# Altium project llrf_afe.PrjPcb (part 3 of 4)

## Sheet llrf_afe_pwr_single_ch.SchDoc: =GlobalProjectName
size 209 x 297 mm; Author: Styuf Alexey; Organization: CosyLab Siberia; Revision: v0.8; SheetNumber: 8; SheetTotal: 17; PageSetup: Record=PageOptions|CenterHorizontal=True|CenterVertical=True|PrintScale=1.00|XCorrection=1.00|YCorrection=1.00|PrintKind=1|BorderSize=5000000|LeftOffset=0|BottomOffset=0|Orientation=2|PaperLength=1000|PaperWidth=1000|Scale=100|PaperSource=15|PrintQuality=1200|MediaType=1|DitherType=10|PaperKind=A3|PrintScaleMode=1; Weight: -; ScaleFactor: -
Used 4 times, as channels pwr/3V3_pwr, pwr/2V5_pwr, pwr/1V8_pwr, pwr/1V2_pwr. Parts and nets are listed once, with the designators drawn on the sheet.
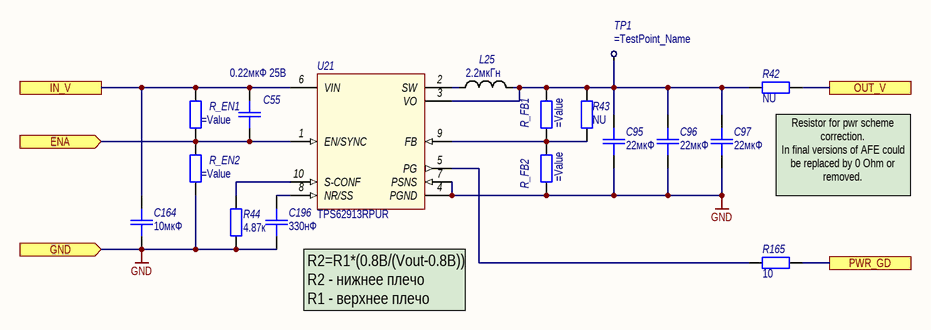
[diagram p13: llrf_afe_pwr_single_ch.SchDoc]

### Parts
C55  0.22мкФ 25В  [SMD_C0603]
C95  22мкФ  [SMD_C0805]
C96  22мкФ  [SMD_C0805]
C97  22мкФ  [SMD_C0805]
C164  10мкФ  [SMD_C0805]
C196  330нФ  [SMD_C0402]
L25  value 2.2мкГн  [SMD_1210]  (hidden comment: Inductor)
R42  NU  [SMD_1206]
R43  NU  [SMD_0603]
R44  4.87к  [SMD_0603]
R165  10  [SMD_0603]
R_EN1  (no value)  [SMD_0603]
R_EN2  (no value)  [SMD_0603]
R_FB1  (no value)  [SMD_0603]
R_FB2  (no value)  [SMD_0603]
TP1  (no value)  [TestPoint]
U21  Наименование: TPS62913RPUR  [RPU0010A]  (hidden comment: TPS62913)

### Ports
ENA (in), GND (in), IN_V, OUT_V, PWR_GD

### Nets
GND: C95.1 C96.1 C97.1 C164.1 C196.1 R44.1 R_EN2.1 R_FB2.1 U21.4(PGND) U21.7(PSNS) ; port GND
ENA: C55.1 R_EN1.1 R_EN2.2 U21.1(EN/SYNC) ; port ENA
IN_V: C55.2 C164.2 R_EN1.2 U21.6(VIN) ; port IN_V
OUT_V: R42.1 ; port OUT_V
PWR_GD: R165.1 ; port PWR_GD
NetC95_2: C95.2 C96.2 C97.2 L25.2 R42.2 R43.2 R_FB1.2 TP1.0(TP) U21.3(VO)
NetC196_2: C196.2 U21.8(NR/SS)
NetL25_1: L25.1 U21.2(SW)
NetR43_1: R43.1 R_FB1.1 R_FB2.2 U21.9(FB)
NetR44_2: R44.2 U21.10(S-CONF)
NetR165_2: R165.2 U21.5(PG)

### Channels
pwr/3V3_pwr: designators end in _3V3_pwr; ports ENA=ENA GND=GND IN_V=12V OUT_V=OUT_V PWR_GD=PWR_GD
pwr/2V5_pwr: designators end in _2V5_pwr; ports ENA=ENA GND=GND IN_V=12V OUT_V=OUT_V PWR_GD=ENA
pwr/1V8_pwr: designators end in _1V8_pwr; ports ENA=ENA GND=GND IN_V=12V OUT_V=OUT_V PWR_GD=ENA
pwr/1V2_pwr: designators end in _1V2_pwr; ports ENA=ENA_1V2_pwr GND=GND IN_V=12V OUT_V=OUT_V PWR_GD=ENA

### Notes on the sheet
- (near R42) Resistor for pwr scheme correction.
  In final versions of AFE could be replaced by 0 Ohm or removed.
- (near C196) R2=R1*(0.8В/(Vout-0.8B))
  R2 - нижнее плечо
  R1 - верхнее плечо
- Подп. и дата
- Инв. № дубл.
- Взам. инв. №
- Инв. № подл.
- Изм.
- Лист
- № докум.
- Подп.
- Дата
- Форма 2а ГОСТ 2.104-2006
- Копировал
- Формат А4

### Library data of the parts
C55 = Capacitor: as C105 on sheet llrf_afe_front_panel; Value: 0.22мкФ 25В
C95-C97 = Capacitor: Назначение: SMD-конденсатор; Наименование: Конденсатор; Потребление, Вт: 0; Диэлектрик: X7R; Точность: 10%; Напряжение: 25В; Описание: Конденсатор X7R 22мкФ 10% 25В; Value: 22мкФ
C164 = Capacitor: Назначение: SMD-конденсатор; Наименование: Конденсатор; Потребление, Вт: 0; Диэлектрик: X7R; Точность: 10%; Напряжение: 25В; Описание: Конденсатор X7R 10мкФ 10% 25В; Value: 10мкФ
C196 = Capacitor: Назначение: SMD-конденсатор; Наименование: Конденсатор; Потребление, Вт: 0; Диэлектрик: X7R; Точность: 10%; Напряжение: 25В; Описание: Конденсатор X7R 330нФ 10% 25В; Value: 330нФ
L25 = Inductor: as L11 on sheet llrf_afe_dds_clock
R42 R43 R165 R_EN1 R_EN2 R_FB1 R_FB2 = Resistor: as R27 on sheet llrf_afe_fpga_bridge
  R42 R43: Value: NU
  R165: Value: 10
  R_EN1: Value: =R_EN1
  R_EN2: Value: =R_EN2
  R_FB1: Value: =R_FB1
  R_FB2: Value: =R_FB2
R44 = Resistor: Наименование: Резистор; Назначение: SMD-резистор; Потребление, Вт: 0.0; Точность: 1%; Описание: Резистор 4.87к 1%; Value: 4.87к
TP1 = TP: as TP9 on sheet llrf_afe_front_panel; TP_Name: =TestPoint_Name
U21 = TPS62913: TPS62913 3-V to 17-V, 3-A Low Noise and Low Ripple Buck Converter; Потребление, Вт: 0.0; Назначение: Buck Converter; ComponentLink1Description: DataSheet; ComponentLink1URL: https://www.ti.com/lit/ds/symlink/tps62913.pdf?ts=1639989978788&ref_url=https%253A%252F%252Fwww.ti.com%252Fproduct%252FTPS62913

## Sheet llrf_afe_pwr_ctrl.SchDoc: =GlobalProjectName
size 209 x 297 mm; Author: Styuf Alexey; Organization: CosyLab Siberia; Revision: v0.8; SheetNumber: 12; SheetTotal: 17; PageSetup: Record=PageOptions|CenterHorizontal=True|CenterVertical=True|PrintScale=1.00|XCorrection=1.00|YCorrection=1.00|PrintKind=1|BorderSize=5000000|LeftOffset=0|BottomOffset=0|Orientation=2|PaperLength=1000|PaperWidth=1000|Scale=100|PaperSource=15|PrintQuality=1200|MediaType=1|DitherType=10|PaperKind=A3|PrintScaleMode=1; Weight: -; ScaleFactor: -
Used 5 times, as channels pwr/3V3_ctrl, pwr/2V5_ctrl, pwr/1V8_ctrl, pwr/12V_ctrl, pwr/1V2_ctrl. Parts and nets are listed once, with the designators drawn on the sheet.
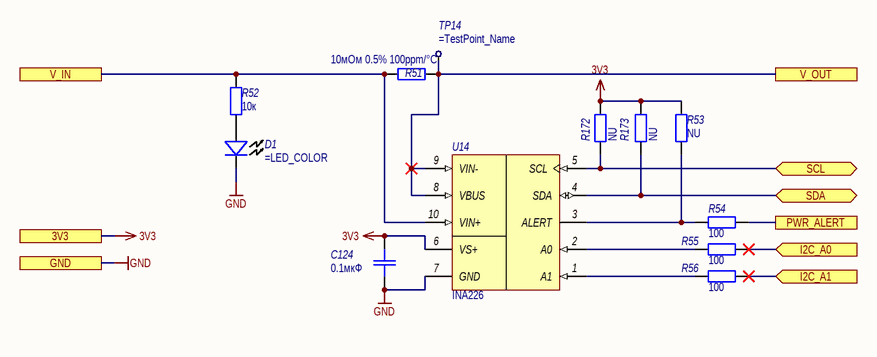
[diagram p14: llrf_afe_pwr_ctrl.SchDoc]

### Parts
C124  0.1мкФ  [SMD_C0402]
D1  LED  [LED-0805]  (value not drawn)
R51  10мОм 0.5% 100ppm/°C  [SMD_1206]
R52  10к  [SMD_0603]
R53  NU  [SMD_0603]
R54  100  [SMD_0603]
R55  100  [SMD_0603]
R56  100  [SMD_0603]
R172  NU  [SMD_0603]
R173  NU  [SMD_0603]
TP14  (no value)  [TestPoint]
U14  INA226  [VSSOP-10]

### Ports
3V3, GND, I2C_A0 (in), I2C_A1 (in), PWR_ALERT, SCL (bidir), SDA (bidir), V_IN, V_OUT

### Nets
3V3: C124.2 R53.2 R172.2 R173.2 U14.6(VS+) ; port 3V3
GND: C124.1 D1.2(K) U14.7(GND) ; port GND
I2C_A0: R55.1 ; port I2C_A0
I2C_A1: R56.1 ; port I2C_A1
PWR_ALERT: R54.1 ; port PWR_ALERT
SCL: R172.1 U14.5(SCL) ; port SCL
SDA: R173.1 U14.4(SDA) ; port SDA
V_IN: R51.2 R52.1 U14.10(VIN+) ; port V_IN
V_OUT: R51.1 TP14.0(TP) U14.8(VBUS) U14.9(VIN-) ; port V_OUT
NetD1_1: D1.1(A) R52.2
NetR53_1: R53.1 R54.2 U14.3(ALERT)
NetR55_2: R55.2 U14.2(A0)
NetR56_2: R56.2 U14.1(A1)

### Channels
pwr/3V3_ctrl: designators end in _3V3_ctrl; ports 3V3=3V3 GND=GND I2C_A0=3V3 I2C_A1=GND PWR_ALERT=FMC_I2C.ALERT SCL=FMC_I2C.SCL SDA=FMC_I2C.SDA V_IN=OUT_V V_OUT=3V3
pwr/2V5_ctrl: designators end in _2V5_ctrl; ports 3V3=3V3 GND=GND I2C_A0=FMC_I2C.SDA I2C_A1=GND PWR_ALERT=FMC_I2C.ALERT SCL=FMC_I2C.SCL SDA=FMC_I2C.SDA V_IN=OUT_V V_OUT=2V5
pwr/1V8_ctrl: designators end in _1V8_ctrl; ports 3V3=3V3 GND=GND I2C_A0=FMC_I2C.SCL I2C_A1=3V3 PWR_ALERT=FMC_I2C.ALERT SCL=FMC_I2C.SCL SDA=FMC_I2C.SDA V_IN=OUT_V V_OUT=1V8
pwr/12V_ctrl: designators end in _12V_ctrl; ports 3V3=3V3 GND=GND I2C_A0=GND I2C_A1=GND PWR_ALERT=FMC_I2C.ALERT SCL=FMC_I2C.SCL SDA=FMC_I2C.SDA V_IN=12V_OUT V_OUT=12V
pwr/1V2_ctrl: designators end in _1V2_ctrl; ports 3V3=3V3 GND=GND I2C_A0=GND I2C_A1=3V3 PWR_ALERT=FMC_I2C.ALERT SCL=FMC_I2C.SCL SDA=FMC_I2C.SDA V_IN=OUT_V V_OUT=1V2

### Notes on the sheet
- Подп. и дата
- Инв. № дубл.
- Взам. инв. №
- Инв. № подл.
- Изм.
- Лист
- № докум.
- Подп.
- Дата
- Форма 2а ГОСТ 2.104-2006
- Копировал
- Формат А4

### Library data of the parts
C124 = Capacitor: Назначение: SMD-конденсатор; Наименование: Конденсатор; Потребление, Вт: 0; Value: 0.1мкФ
D1 = LED: Назначение: Светодиод; Наименование: SMD-LED; Потребление, Вт: 0,01; Value: =LED_COLOR
R51 = Resistor: PE1206DRM470R01L; Наименование: Резистор; Назначение: SMD-резистор; Потребление, Вт: 0,001; Value: 10мОм 0.5% 100ppm/°C
R52-R56 R172 R173 = Resistor: Наименование: Резистор; Назначение: SMD-резистор; Потребление, Вт: 0,001
  R52: Value: 10к
  R53 R172 R173: Value: NU
  R54-R56: Value: 100
TP14 = TP: Наименование: Точка проверки; Назначение: Контроль параметров платы; TP_Name: =TestPoint_Name
U14 = INA226: High- or Low-Side Measurement, Bidirectional Current and Power Monitor With I2C Interface; Назначение: High-Side or Low-Side Measurement,; Потребление, Вт: 0,001; ComponentLink1Description: Data sheet; ComponentLink1URL: http://www.ti.com/lit/ds/symlink/ina226.pdf; DataSheet: https://www.ti.com/lit/ds/symlink/ina226.pdf?ts=1592809211957&ref_url=https%253A%252F%252Fwww.google.com%252F; Наименование: INA226

## Sheet llrf_afe_pwr_input.SchDoc: =GlobalProjectName
size 209 x 297 mm; Author: Styuf Alexey; Organization: CosyLab Siberia; Revision: v0.8; SheetNumber: 17; SheetTotal: 17; PageSetup: Record=PageOptions|CenterHorizontal=True|CenterVertical=True|PrintScale=1.00|XCorrection=1.00|YCorrection=1.00|PrintKind=1|BorderSize=5000000|LeftOffset=0|BottomOffset=0|Orientation=2|PaperLength=1000|PaperWidth=1000|Scale=100|PaperSource=15|PrintQuality=1200|MediaType=1|DitherType=10|PaperKind=A3|PrintScaleMode=1; Weight: -; ScaleFactor: -
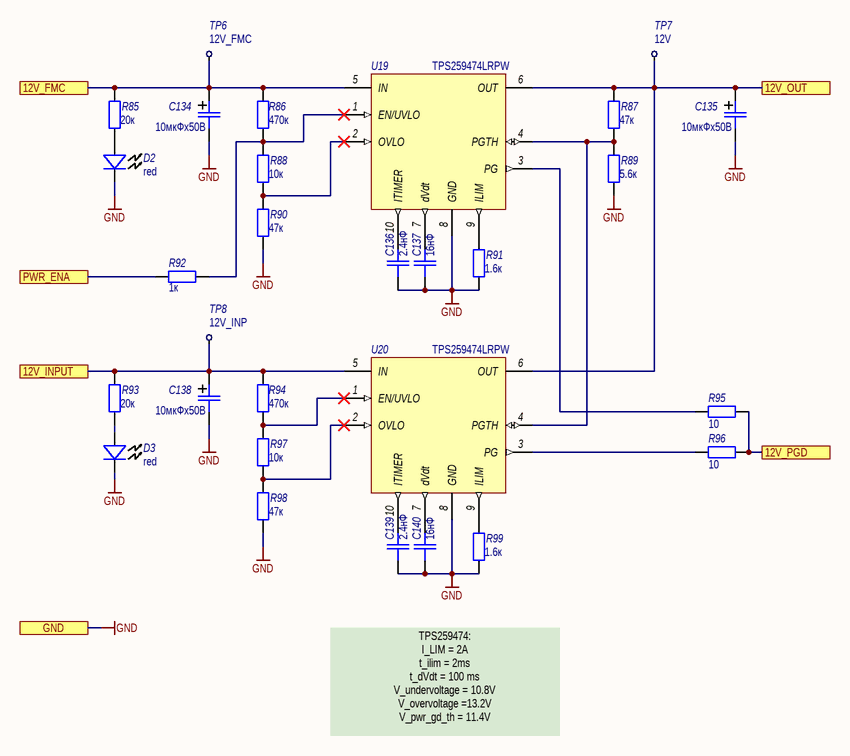
[diagram p15: llrf_afe_pwr_input.SchDoc]

### Parts
C134  10мкФх50В  [SMD_size_B]
C135  10мкФх50В  [SMD_size_B]
C136  2.4нФ  [SMD_C0603]
C137  16нФ  [SMD_C0603]
C138  10мкФх50В  [SMD_size_B]
C139  2.4нФ  [SMD_C0603]
C140  16нФ  [SMD_C0603]
D2  value red  [LED-0805]  (hidden comment: LED)
D3  value red  [LED-0805]  (hidden comment: LED)
R85  20к  [SMD_0603]
R86  470к  [SMD_0603]
R87  47к  [SMD_0603]
R88  10к  [SMD_0603]
R89  5.6к  [SMD_0603]
R90  47к  [SMD_0603]
R91  1.6к  [SMD_0603]
R92  1к  [SMD_0603]
R93  20к  [SMD_0603]
R94  470к  [SMD_0603]
R95  10  [SMD_0603]
R96  10  [SMD_0603]
R97  10к  [SMD_0603]
R98  47к  [SMD_0603]
R99  1.6к  [SMD_0603]
TP6  12V_FMC  [TestPoint]
TP7  12V  [TestPoint]
TP8  12V_INP  [TestPoint]
U19  Наименование: TPS259474LRPW  [VQFN-HR-10]  (hidden comment: TPS25947x)
U20  Наименование: TPS259474LRPW  [VQFN-HR-10]  (hidden comment: TPS25947x)

### Ports
12V_FMC, 12V_INPUT, 12V_OUT, 12V_PGD, GND, PWR_ENA

### Nets
+12V_FMC: C134.1 R85.2 R86.2 TP6.0(TP) U19.5(IN) ; port 12V_FMC
+12V_INPUT: C138.1 R93.2 R94.2 TP8.0(TP) U20.5(IN) ; port 12V_INPUT
GND: C134.2 C135.2 C136.1 C137.1 C138.2 C139.1 C140.1 D2.2(K) D3.2(K) R89.1 R90.1 R91.1 R98.1 R99.1 U19.8(GND) U20.8(GND) ; port GND
12V_OUT: C135.1 R87.2 TP7.0(TP) U19.6(OUT) U20.6(OUT) ; port 12V_OUT
PWR_ENA: R92.2 ; port PWR_ENA
PWR_GD: R95.1 R96.1 ; port 12V_PGD
NetC136_2: C136.2 U19.10(ITIMER)
NetC137_2: C137.2 U19.7(dVdt)
NetC139_2: C139.2 U20.10(ITIMER)
NetC140_2: C140.2 U20.7(dVdt)
NetD2_1: D2.1(A) R85.1
NetD3_1: D3.1(A) R93.1
NetR86_1: R86.1 R88.2 R92.1 U19.1(EN/UVLO)
NetR87_1: R87.1 R89.2 U19.4(PGTH) U20.4(PGTH)
NetR88_1: R88.1 R90.2 U19.2(OVLO)
NetR91_2: R91.2 U19.9(ILIM)
NetR94_1: R94.1 R97.2 U20.1(EN/UVLO)
NetR95_2: R95.2 U19.3(PG)
NetR96_2: R96.2 U20.3(PG)
NetR97_1: R97.1 R98.2 U20.2(OVLO)
NetR99_2: R99.2 U20.9(ILIM)

### Notes on the sheet
- TPS259474:
  I_LIM = 2A
  t_ilim = 2ms
  t_dVdt = 100 ms
  V_undervoltage = 10.8V
  V_overvoltage =13.2V
  V_pwr_gd_th = 11.4V
- Подп. и дата
- Инв. № дубл.
- Взам. инв. №
- Инв. № подл.
- Изм.
- Лист
- № докум.
- Подп.
- Дата
- Форма 2а ГОСТ 2.104-2006
- Копировал
- Формат А4

### Library data of the parts
C134 C135 C138 = Capacitor_pol: Polarized capacitor; Назначение: Поляризованный SMD-конденсатор; Наименование: Поляризованный конденсатор; Потребление, Вт: 0; Value: 10мкФх50В
C136 C137 C139 C140 = Capacitor: Назначение: SMD-конденсатор; Наименование: Конденсатор; Потребление, Вт: 0; Точность: %; Напряжение: В; Диэлектрик: *
  C136 C139: Value: 2.4нФ
  C137 C140: Value: 16нФ
D2 D3 = LED: as D1 on sheet llrf_afe_pwr_ctrl
R85-R99 = Resistor: as R52-R56 on sheet llrf_afe_pwr_ctrl
  R85 R93: Value: 20к
  R86 R94: Value: 470к
  R87 R90 R98: Value: 47к
  R88 R97: Value: 10к
  R89: Value: 5.6к
  R91 R99: Value: 1.6к
  R92: Value: 1к
  R95 R96: Value: 10
TP6-TP8 = TP: as TP14 on sheet llrf_afe_pwr_ctrl
  TP6: TP_Name: 12V_FMC
  TP7: TP_Name: 12V
  TP8: TP_Name: 12V_INP
U19 U20 = TPS25947x: TPS25947xx, 2.7 - 23 V, 5.5 A, 28-mΩ True Reverse Current Blocking eFuse with Input / Reverse Polarity Protection /; Потребление, Вт: 0,05; Назначение: 2.7 - 23 V, 5.5 A, 28-mΩ True Reverse Current Blocking eFuse with Input; ComponentLink1Description: DataSheet; ComponentLink1URL: https://www.ti.com/lit/ds/symlink/tps25947.pdf?ts=1621925066842&ref_url=https%253A%252F%252Fwww.ti.com%252Fproduct%252FTPS25947%253FkeyMatch%253DTPS25947%2526tisearch%253Dsearch-everything%2526usecase%253DGPN

## Sheet llrf_afe_fpga_pwr.SchDoc: =GlobalProjectName
size 209 x 297 mm; Author: Styuf Alexey; Organization: CosyLab Siberia; Revision: v0.8; SheetNumber: 12; SheetTotal: 20; PageSetup: Record=PageOptions|CenterHorizontal=True|CenterVertical=True|PrintScale=1.00|XCorrection=1.00|YCorrection=1.00|PrintKind=1|BorderSize=5000000|LeftOffset=0|BottomOffset=0|Orientation=2|PaperLength=1000|PaperWidth=1000|Scale=100|PaperSource=15|PrintQuality=1200|MediaType=1|DitherType=10|PaperKind=A3|PrintScaleMode=1; Weight: -; ScaleFactor: -
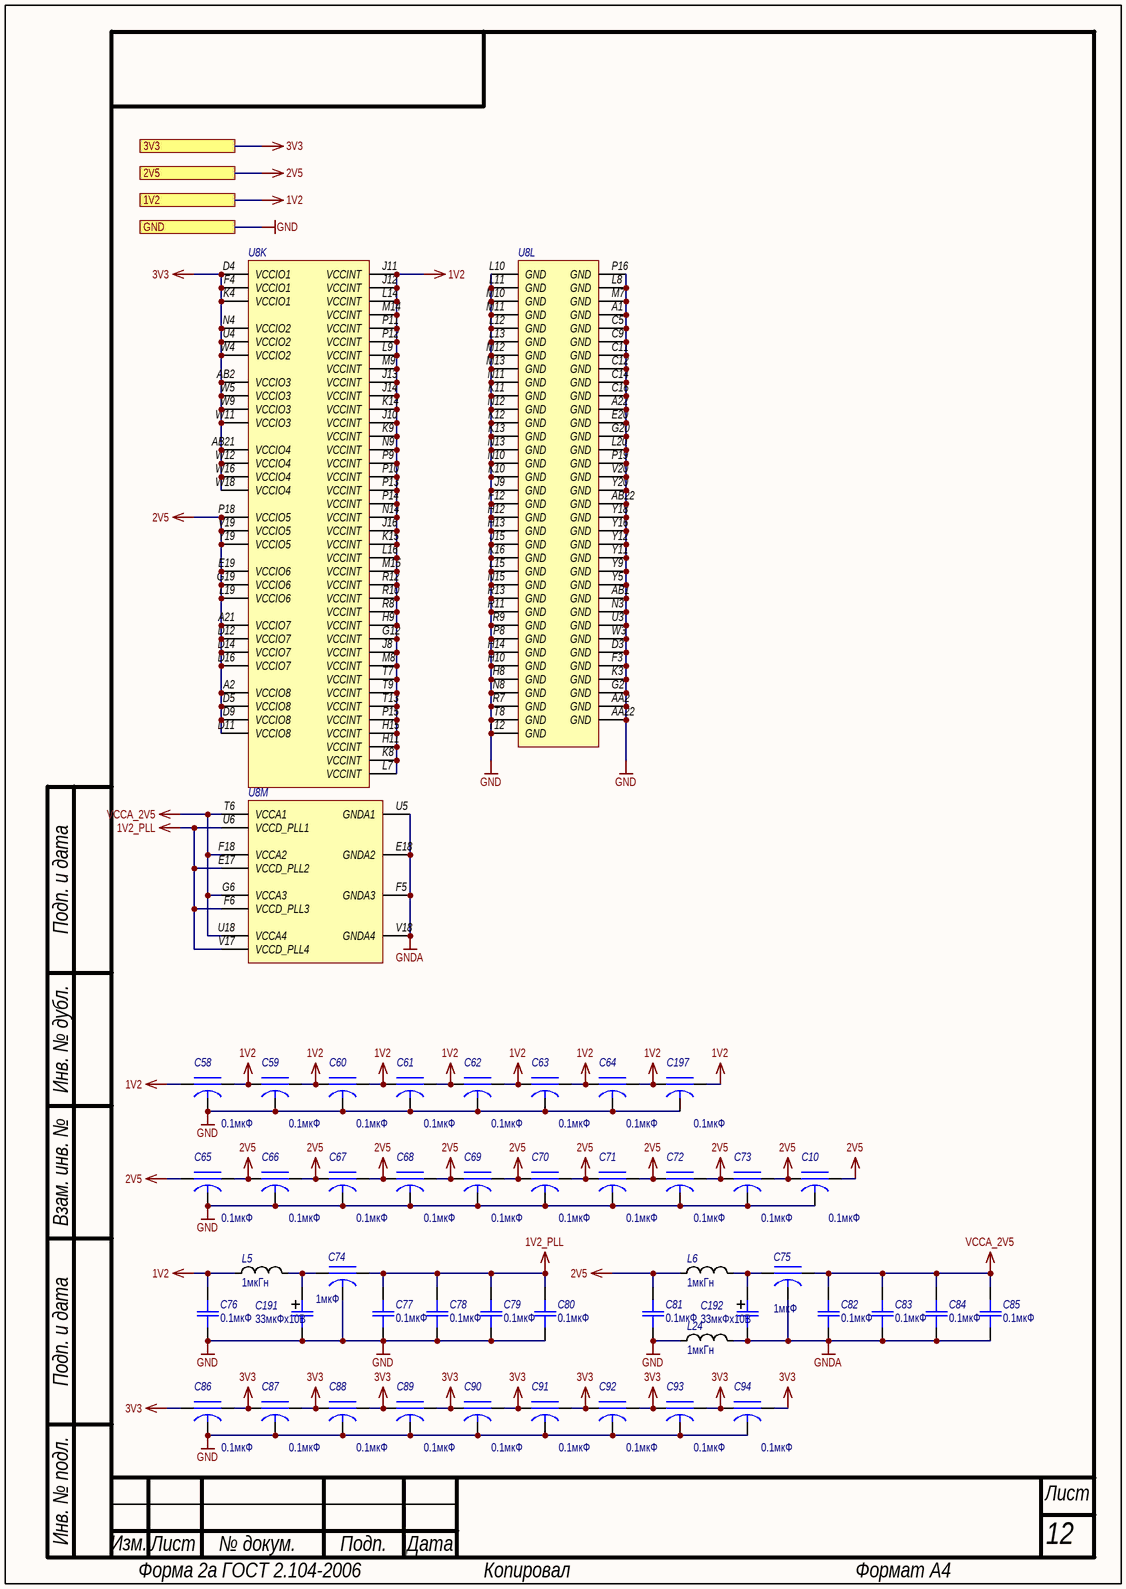
[diagram p16: llrf_afe_fpga_pwr.SchDoc]

### Parts
C10  value 0.1мкФ  [3pol_SMD0402]  (hidden comment: NFM15PC104D0J3)
C58  value 0.1мкФ  [3pol_SMD0402]  (hidden comment: NFM15PC104D0J3)
C59  value 0.1мкФ  [3pol_SMD0402]  (hidden comment: NFM15PC104D0J3)
C60  value 0.1мкФ  [3pol_SMD0402]  (hidden comment: NFM15PC104D0J3)
C61  value 0.1мкФ  [3pol_SMD0402]  (hidden comment: NFM15PC104D0J3)
C62  value 0.1мкФ  [3pol_SMD0402]  (hidden comment: NFM15PC104D0J3)
C63  value 0.1мкФ  [3pol_SMD0402]  (hidden comment: NFM15PC104D0J3)
C64  value 0.1мкФ  [3pol_SMD0402]  (hidden comment: NFM15PC104D0J3)
C65  value 0.1мкФ  [3pol_SMD0402]  (hidden comment: NFM15PC104D0J3)
C66  value 0.1мкФ  [3pol_SMD0402]  (hidden comment: NFM15PC104D0J3)
C67  value 0.1мкФ  [3pol_SMD0402]  (hidden comment: NFM15PC104D0J3)
C68  value 0.1мкФ  [3pol_SMD0402]  (hidden comment: NFM15PC104D0J3)
C69  value 0.1мкФ  [3pol_SMD0402]  (hidden comment: NFM15PC104D0J3)
C70  value 0.1мкФ  [3pol_SMD0402]  (hidden comment: NFM15PC104D0J3)
C71  value 0.1мкФ  [3pol_SMD0402]  (hidden comment: NFM15PC104D0J3)
C72  value 0.1мкФ  [3pol_SMD0402]  (hidden comment: NFM15PC104D0J3)
C73  value 0.1мкФ  [3pol_SMD0402]  (hidden comment: NFM15PC104D0J3)
C74  value 1мкФ  [3pol_SMD0402]  (hidden comment: NFM15PC105D0J3)
C75  value 1мкФ  [3pol_SMD0402]  (hidden comment: NFM15PC105D0J3)
C76  0.1мкФ  [SMD_C0402]
C77  0.1мкФ  [SMD_C0402]
C78  0.1мкФ  [SMD_C0402]
C79  0.1мкФ  [SMD_C0402]
C80  0.1мкФ  [SMD_C0402]
C81  0.1мкФ  [SMD_C0402]
C82  0.1мкФ  [SMD_C0402]
C83  0.1мкФ  [SMD_C0402]
C84  0.1мкФ  [SMD_C0402]
C85  0.1мкФ  [SMD_C0402]
C86  value 0.1мкФ  [3pol_SMD0402]  (hidden comment: NFM15PC104D0J3)
C87  value 0.1мкФ  [3pol_SMD0402]  (hidden comment: NFM15PC104D0J3)
C88  value 0.1мкФ  [3pol_SMD0402]  (hidden comment: NFM15PC104D0J3)
C89  value 0.1мкФ  [3pol_SMD0402]  (hidden comment: NFM15PC104D0J3)
C90  value 0.1мкФ  [3pol_SMD0402]  (hidden comment: NFM15PC104D0J3)
C91  value 0.1мкФ  [3pol_SMD0402]  (hidden comment: NFM15PC104D0J3)
C92  value 0.1мкФ  [3pol_SMD0402]  (hidden comment: NFM15PC104D0J3)
C93  value 0.1мкФ  [3pol_SMD0402]  (hidden comment: NFM15PC104D0J3)
C94  value 0.1мкФ  [3pol_SMD0402]  (hidden comment: NFM15PC104D0J3)
C191  33мкФх10В  [SMD_size_B]
C192  33мкФх10В  [SMD_size_B]
C197  value 0.1мкФ  [3pol_SMD0402]  (hidden comment: NFM15PC104D0J3)
L5  1мкГн  [SMD_0805]
L6  1мкГн  [SMD_0805]
L24  1мкГн  [SMD_0805]
U8  EP4CE55F23C8  [FBGA484_A-240]  (value not drawn)  (parts K,L,M of 13)

### Ports
1V2, 2V5, 3V3, GND

### Nets
1V2: C58.1(Input) C58.3(Output) C59.1(Input) C59.3(Output) C60.1(Input) C60.3(Output) C61.1(Input) C61.3(Output) C62.1(Input) C62.3(Output) C63.1(Input) C63.3(Output) C64.1(Input) C64.3(Output) C76.2 C197.1(Input) C197.3(Output) L5.2 U8.G12(VCCINT) U8.H9(VCCINT) U8.H11(VCCINT) U8.H15(VCCINT) U8.J8(VCCINT) U8.J10(VCCINT) U8.J11(VCCINT) U8.J12(VCCINT) U8.J13(VCCINT) U8.J14(VCCINT) U8.J16(VCCINT) U8.K8(VCCINT) U8.K9(VCCINT) U8.K14(VCCINT) U8.K15(VCCINT) U8.L7(VCCINT) U8.L9(VCCINT) U8.L14(VCCINT) U8.L16(VCCINT) U8.M8(VCCINT) U8.M9(VCCINT) U8.M14(VCCINT) U8.M15(VCCINT) U8.N9(VCCINT) U8.N14(VCCINT) U8.P9(VCCINT) U8.P10(VCCINT) U8.P11(VCCINT) U8.P12(VCCINT) U8.P13(VCCINT) U8.P14(VCCINT) U8.P15(VCCINT) U8.R8(VCCINT) U8.R10(VCCINT) U8.R12(VCCINT) U8.T7(VCCINT) U8.T9(VCCINT) U8.T13(VCCINT) ; port 1V2
1V2_PLL: C74.1(Input) C77.2 C78.2 C79.2 C80.2 U8.E17(VCCD_PLL2) U8.F6(VCCD_PLL3) U8.U6(VCCD_PLL1) U8.V17(VCCD_PLL4)
2V5: C10.1(Input) C10.3(Output) C65.1(Input) C65.3(Output) C66.1(Input) C66.3(Output) C67.1(Input) C67.3(Output) C68.1(Input) C68.3(Output) C69.1(Input) C69.3(Output) C70.1(Input) C70.3(Output) C71.1(Input) C71.3(Output) C72.1(Input) C72.3(Output) C73.1(Input) C73.3(Output) C81.2 L6.2 U8.A2(VCCIO8) U8.A21(VCCIO7) U8.D5(VCCIO8) U8.D9(VCCIO8) U8.D11(VCCIO8) U8.D12(VCCIO7) U8.D14(VCCIO7) U8.D16(VCCIO7) U8.E19(VCCIO6) U8.G19(VCCIO6) U8.L19(VCCIO6) U8.P18(VCCIO5) U8.V19(VCCIO5) U8.Y19(VCCIO5) ; port 2V5
3V3: C86.1(Input) C86.3(Output) C87.1(Input) C87.3(Output) C88.1(Input) C88.3(Output) C89.1(Input) C89.3(Output) C90.1(Input) C90.3(Output) C91.1(Input) C91.3(Output) C92.1(Input) C92.3(Output) C93.1(Input) C93.3(Output) C94.1(Input) C94.3(Output) U8.AB2(VCCIO3) U8.AB21(VCCIO4) U8.D4(VCCIO1) U8.F4(VCCIO1) U8.K4(VCCIO1) U8.N4(VCCIO2) U8.U4(VCCIO2) U8.W4(VCCIO2) U8.W5(VCCIO3) U8.W9(VCCIO3) U8.W11(VCCIO3) U8.W12(VCCIO4) U8.W16(VCCIO4) U8.W18(VCCIO4) ; port 3V3
GND: C10.2(GND) C58.2(GND) C59.2(GND) C60.2(GND) C61.2(GND) C62.2(GND) C63.2(GND) C64.2(GND) C65.2(GND) C66.2(GND) C67.2(GND) C68.2(GND) C69.2(GND) C70.2(GND) C71.2(GND) C72.2(GND) C73.2(GND) C74.2(GND) C76.1 C77.1 C78.1 C79.1 C80.1 C81.1 C86.2(GND) C87.2(GND) C88.2(GND) C89.2(GND) C90.2(GND) C91.2(GND) C92.2(GND) C93.2(GND) C94.2(GND) C191.2 C197.2(GND) L24.2 U8.A1(GND) U8.A22(GND) U8.AA2(GND) U8.AA22(GND) U8.AB1(GND) U8.AB22(GND) U8.C5(GND) U8.C9(GND) U8.C11(GND) U8.C12(GND) U8.C14(GND) U8.C16(GND) U8.D3(GND) U8.E20(GND) U8.F3(GND) U8.F12(GND) U8.G2(GND) U8.G20(GND) U8.H8(GND) U8.H10(GND) U8.H12(GND) U8.H13(GND) U8.H14(GND) U8.J9(GND) U8.J15(GND) U8.K3(GND) U8.K10(GND) U8.K11(GND) U8.K12(GND) U8.K13(GND) U8.K16(GND) U8.L8(GND) U8.L10(GND) U8.L11(GND) U8.L12(GND) U8.L13(GND) U8.L15(GND) U8.L20(GND) U8.M7(GND) U8.M10(GND) U8.M11(GND) U8.M12(GND) U8.M13(GND) U8.N3(GND) U8.N8(GND) U8.N10(GND) U8.N11(GND) U8.N12(GND) U8.N13(GND) U8.N15(GND) U8.P8(GND) U8.P16(GND) U8.P19(GND) U8.R7(GND) U8.R9(GND) U8.R11(GND) U8.R13(GND) U8.T8(GND) U8.T12(GND) U8.U3(GND) U8.V20(GND) U8.W3(GND) U8.Y5(GND) U8.Y9(GND) U8.Y11(GND) U8.Y12(GND) U8.Y16(GND) U8.Y18(GND) U8.Y20(GND) ; port GND
GNDA: C75.2(GND) C82.1 C83.1 C84.1 C85.1 C192.2 L24.1 U8.E18(GNDA2) U8.F5(GNDA3) U8.U5(GNDA1) U8.V18(GNDA4)
VCCA_2V5: C75.1(Input) C82.2 C83.2 C84.2 C85.2 U8.F18(VCCA2) U8.G6(VCCA3) U8.T6(VCCA1) U8.U18(VCCA4)
NetC74_3: C74.3(Output) C191.1 L5.1
NetC75_3: C75.3(Output) C192.1 L6.1

### Notes on the sheet
- Подп. и дата
- Инв. № дубл.
- Взам. инв. №
- Инв. № подл.
- Изм.
- Лист
- № докум.
- Подп.
- Дата
- Форма 2а ГОСТ 2.104-2006
- Копировал
- Формат А4

### Library data of the parts
C10 C58-C75 C86-C94 C197 = Capacitop_3Pol: Large Current 3 Terminals Low ESL Chip Multilayer Ceramic Capacitors for General Purpose, 0402, 2200pF, 20%, 10V; Потребление, Вт: 0.0; Назначение: 3 Terminals Low ESL Chip Multilayer Ceramic Capacitors (EMIFIL) for General Purpose; ComponentLink1Description: DataSheet; ComponentLink1URL: https://search.murata.co.jp/Ceramy/image/img/A01X/G101/ENG/NFM15CC222D1A3-01.pdf; ComponentLink2Description: UsingMethod; ComponentLink2URL: https://article.murata.com/en-global/article/methods-of-using-low-esl-capacitors
  C10 C58-C73 C86-C94 C197: Наименование: NFM15PC104D0J3
  C74 C75: Наименование: NFM15PC105D0J3
C76-C85 = Capacitor: as C124 on sheet llrf_afe_pwr_ctrl; Value: 0.1мкФ
C191 C192 = Capacitor_pol: as C134 on sheet llrf_afe_pwr_input; Value: 33мкФх10В
L5 L6 L24 = Inductor: Наименование: Индуктивность; Назначение: SMD-индуктивность; Потребление, Вт: 0,010; Value: 1мкГн
U8 = CMP-0038-00002-2: Cyclone IV Family FPGA, 1.2V Core, 324 I/O Pins, 4 PLLs, 484-Pin FBGA, Speed Grade 8, Commercial Grade; Manufacturer: Altera; PackageDescription: 484-Pin FineLine Ball Grid Array (FBGA) - Wire Bond - A:2.40; ComponentLink2Description: Handbook; Code_JEDEC: MS-034-AAJ-1; ComponentLink2URL: http://www.altera.com/literature/hb/cyclone-iv/cyclone4-handbook.pdf; ComponentLink1URL: http://www.altera.com/; PackageVersion: ver1.0, Jun-2011; ComponentLink3URL: http://www.altera.com/literature/lit-dp.jsp?category=cyc%204&showspreadsheet=y; ComponentLink4Description: Package Specification; ComponentLink4URL: http://www.altera.com/devicepackaging/04R00247-02.pdf; ComponentLink1Description: Manufacturer URL; RevisionNote: DatasheetVersion updated. URLs added. PCB updated.; PackageReference: FBGA484_A-240; DatasheetVersion: ver1.6, Nov-2011; ComponentLink3Description: Pinout

## Sheet llrf_afe_usb_ftdi.SchDoc: =GlobalProjectName
size 209 x 297 mm; Author: Styuf Alexey; Organization: CosyLab Siberia; Revision: v0.8; SheetNumber: 16; SheetTotal: 17; PageSetup: Record=PageOptions|CenterHorizontal=True|CenterVertical=True|PrintScale=1.00|XCorrection=1.00|YCorrection=1.00|PrintKind=1|BorderSize=5000000|LeftOffset=0|BottomOffset=0|Orientation=2|PaperLength=1000|PaperWidth=1000|Scale=100|PaperSource=15|PrintQuality=1200|MediaType=1|DitherType=10|PaperKind=A3|PrintScaleMode=1; Weight: -; ScaleFactor: -
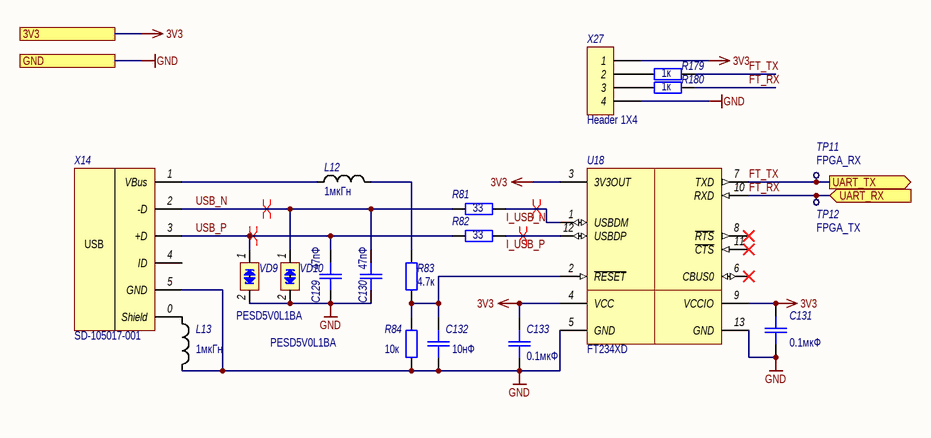
[diagram p17: llrf_afe_usb_ftdi.SchDoc]

### Parts
C129  47пФ  [SMD_C0402]
C130  47пФ  [SMD_C0402]
C131  0.1мкФ  [SMD_C0402]
C132  10нФ  [SMD_C0402]
C133  0.1мкФ  [SMD_C0402]
L12  1мкГн  [SMD_0805]
L13  1мкГн  [SMD_0805]
R81  33  [SMD_0603]
R82  33  [SMD_0603]
R83  4.7к  [SMD_0603]
R84  10к  [SMD_0603]
R179  1к  [SMD_0603]
R180  1к  [SMD_0603]
TP11  FPGA_RX  [TestPoint]
TP12  FPGA_TX  [TestPoint]
U18  FT234XD  [DFN-12]
VD9  Наименование: PESD5V0L1BA  [SOD-323]  (hidden comment: PESD5V0)
VD10  Наименование: PESD5V0L1BA  [SOD-323]  (hidden comment: PESD5V0)
X14  Наименование: SD-105017-001  [MicroUSB-Molex-105017]  (hidden comment: mico-BF)
X27  Header 1X4  [PLS-4]

### Ports
3V3, GND, UART_RX (in), UART_TX (out)

### Nets
3V3: C131.2 C133.2 U18.3(3V3OUT) U18.4(VCC) U18.9(VCCIO) X27.1 ; port 3V3
GND: C129.1 C130.1 C131.1 C132.1 C133.1 L13.2 R84.1 U18.5(GND) U18.13(GND) VD9.2(cathode_2) VD10.2(cathode_2) X14.5(GND) X27.4 ; port GND
FT_RX: R180.1 TP12.0(TP) U18.10(RXD) ; port UART_RX  [project net FPGA_TX]
FT_TX: R179.1 TP11.0(TP) U18.7(TXD) ; port UART_TX  [project net FPGA_RX]
I_USB_N: R81.1 U18.1(USBDM)
I_USB_P: R82.1 U18.12(USBDP)
USB_N: C130.2 R81.2 VD10.1(cathode_1) X14.2(-D)
USB_P: C129.2 R82.2 VD9.1(cathode_1) X14.3(+D)
NetC132_2: C132.2 R83.2 R84.2 U18.2(~{RESET})
NetL12_1: L12.1 X14.1(VBus)
NetL12_2: L12.2 R83.1
NetL13_1: L13.1 X14.0(Shield)
NetR179_2: R179.2 X27.2
NetR180_2: R180.2 X27.3

Not connected (* = marked no-connect by the designer): U18 6(CBUS0)* 8(~{RTS})* 11(~{CTS})*; X14 4(ID)

### Layout directives
differential pair: I_USB_N, I_USB_P, USB_N, USB_P

### Notes on the sheet
- Подп. и дата
- Инв. № дубл.
- Взам. инв. №
- Инв. № подл.
- Изм.
- Лист
- № докум.
- Подп.
- Дата
- Форма 2а ГОСТ 2.104-2006
- Копировал
- Формат А4
- (in symbol MicroUSB) USB

### Library data of the parts
C129-C133 = Capacitor: as C124 on sheet llrf_afe_pwr_ctrl
  C129 C130: Value: 47пФ
  C131 C133: Value: 0.1мкФ
  C132: Value: 10нФ
L12 L13 = Inductor: as L5 on sheet llrf_afe_fpga_pwr; Value: 1мкГн
R81-R84 R179 R180 = Resistor: as R51 on sheet llrf_afe_pwr_ctrl
  R81 R82: Value: 33
  R83: Value: 4.7к
  R84: Value: 10к
  R179 R180: Value: 1к
TP11 TP12 = TP: as TP14 on sheet llrf_afe_pwr_ctrl
  TP11: TP_Name: FPGA_RX
  TP12: TP_Name: FPGA_TX
U18 = FT234XD: USB TO BASIC UART IC; Потребление, Вт: 0.03; Назначение: USB TO BASIC UART IC; ComponentLink1Description: DataSheet; ComponentLink1URL: https://ftdichip.com/wp-content/uploads/2020/08/DS_FT234XD.pdf; Supplier 1: Newark; Supplier Part Number 1: 53X3171; Наименование: FT234XD
VD9 VD10 = PESDxL1BA: Low capacitance bidirectional ESD protection diodes; Назначение: ESD защитные диоды; Потребление, Вт: 0.0; ComponentLink1Description: DataSheet; ComponentLink1URL: https://static.chipdip.ru/lib/635/DOC005635911.pdf
X14 = MicroUSB: MicroUSB bottom mount receptacle, B-type; Потребление, Вт: 0; Назначение: MicroUSB bottom mount receptacle, B-type; DataSheet: *
X27 = Header 1X4: Header, 4-Pin, Single row; Потребление, Вт: 0,0; Назначение: Header, 4-Pin, Single row; Наименование: Header 1X4

## Sheet llrf_afe_fpga_conf.SchDoc: =GlobalProjectName
size 209 x 297 mm; Author: Styuf Alexey; Organization: CosyLab Siberia; Revision: v0.8; SheetNumber: Лист; SheetTotal: Листов; PageSetup: Record=PageOptions|CenterHorizontal=True|CenterVertical=True|PrintScale=1.00|XCorrection=1.00|YCorrection=1.00|PrintKind=1|BorderSize=5000000|LeftOffset=0|BottomOffset=0|Orientation=2|PaperLength=1000|PaperWidth=1000|Scale=100|PaperSource=15|PrintQuality=1200|MediaType=1|DitherType=10|PaperKind=A3|PrintScaleMode=1; Weight: -; ScaleFactor: -
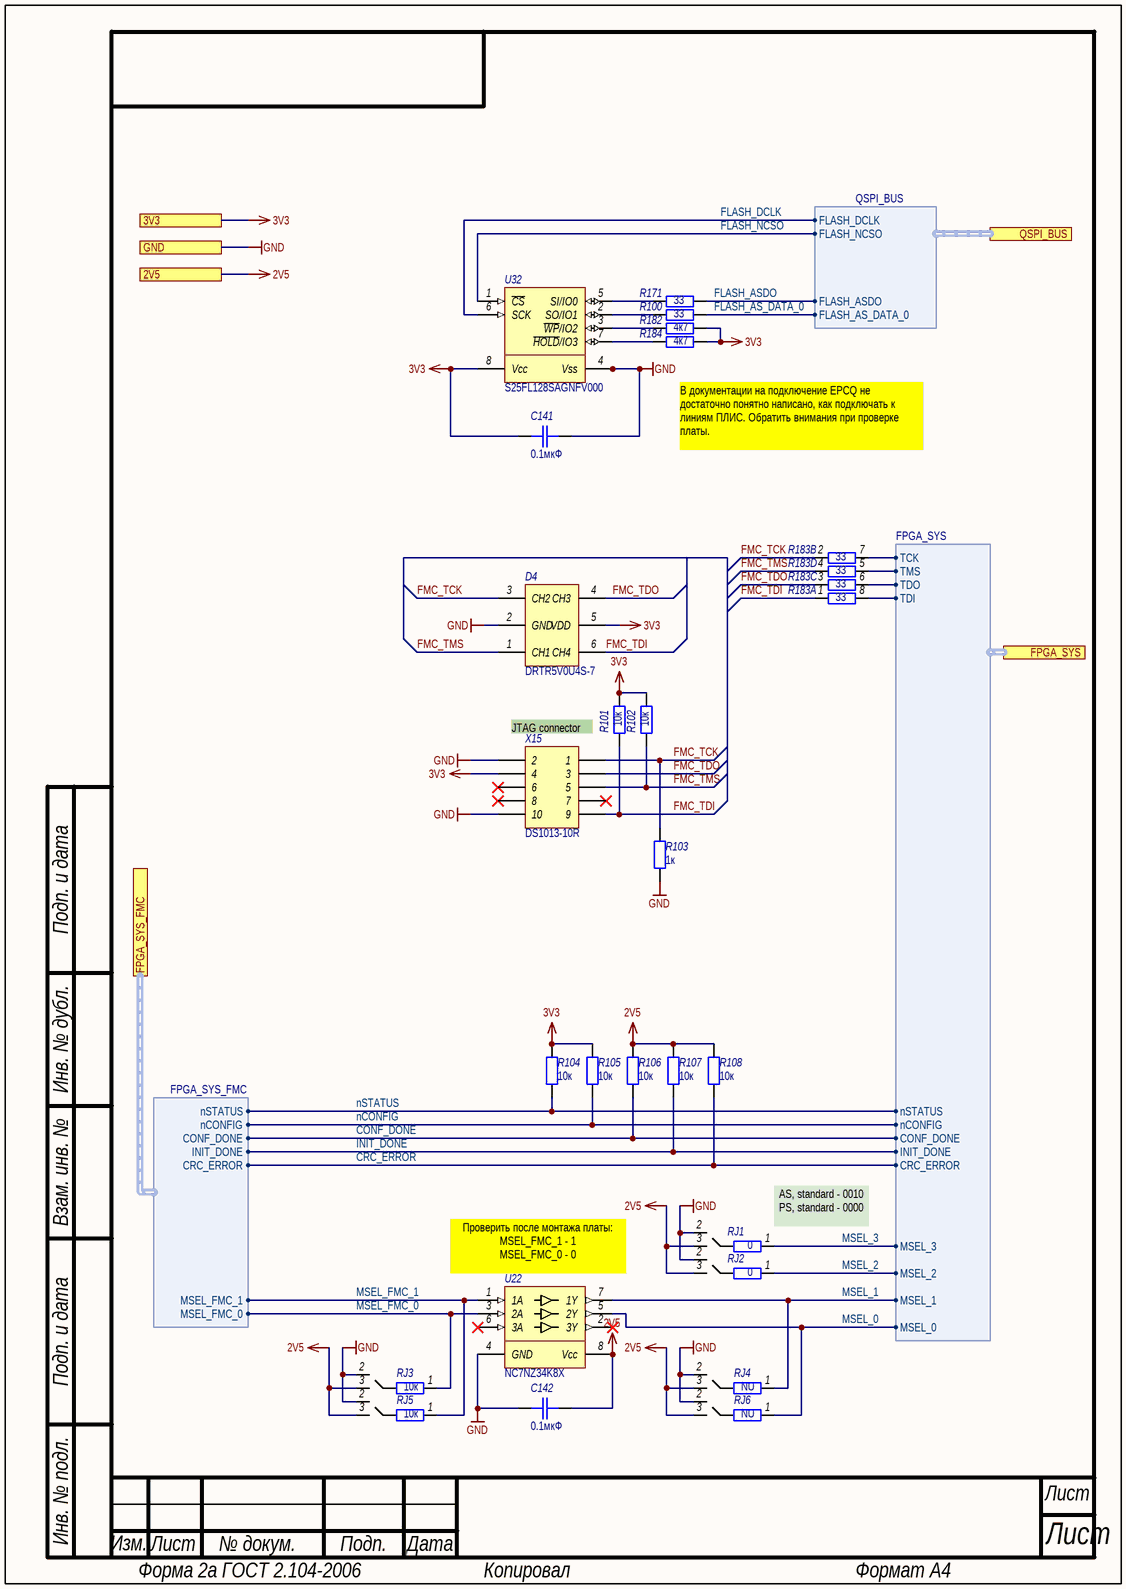
[diagram p18: llrf_afe_fpga_conf.SchDoc]

### Parts
C141  0.1мкФ  [SMD_C0402]
C142  0.1мкФ  [SMD_C0402]
D4  Наименование: DRTR5V0U4S-7  [SOT-363]  (hidden comment: DRTR5V0U4S)
R100  33  [SMD_0603]
R101  10к  [SMD_0603]
R102  10к  [SMD_0603]
R103  1к  [SMD_0603]
R104  10к  [SMD_0603]
R105  10к  [SMD_0603]
R106  10к  [SMD_0603]
R107  10к  [SMD_0603]
R108  10к  [SMD_0603]
R171  33  [SMD_0603]
R182  4к7  [SMD_0603]
R183  value 33  [TC124]  (hidden comment: 4 Chip Resistor Array)  (parts A,B,C,D of 4)
R184  4к7  [SMD_0603]
RJ1  0  [SMD_JMP_0603]
RJ2  0  [SMD_JMP_0603]
RJ3  10к  [SMD_JMP_0603]
RJ4  NU  [SMD_JMP_0603]
RJ5  10к  [SMD_JMP_0603]
RJ6  NU  [SMD_JMP_0603]
U22  Наименование: NC7NZ34K8X  [US-8]  (hidden comment: NC7NZ34)
U32  Наименование: S25FL128SAGNFV000  [WSON-8_6x8]  (hidden comment: S25FL128SAGN)
X15  DS1013-10R  [DS1013-10R]

### Ports
2V5, 3V3, FPGA_SYS (harness FPGA_SYS), FPGA_SYS_FMC (harness FPGA_SYS_FMC), GND, QSPI_BUS (harness QSPI_BUS)

### Harnesses
QSPI_BUS: FLASH_ASDO, FLASH_NCSO, FLASH_DCLK, FLASH_AS_DATA_0
FPGA_SYS: TCK, TMS, TDO, TDI, CRC_ERROR, INIT_DONE, nSTATUS, CONF_DONE, nCONFIG, MSEL_0, MSEL_1, MSEL_2, MSEL_3
FPGA_SYS_FMC: INIT_DONE, nSTATUS, CONF_DONE, nCONFIG, MSEL_FMC_0, MSEL_FMC_1, CRC_ERROR

### Nets
2V5: C142.2 R106.2 R107.2 R108.2 RJ1.3 RJ2.3 RJ3.3 RJ4.3 RJ5.3 RJ6.3 U22.8(Vcc) ; port 2V5
3V3: C141.2 D4.5(VDD) R101.2 R102.2 R104.2 R105.2 R182.1 R184.1 U32.8(Vcc) X15.4 ; port 3V3
GND: C141.1 C142.1 D4.2(GND) R103.1 RJ1.2 RJ2.2 RJ3.2 RJ4.2 RJ5.2 RJ6.2 U22.4(GND) U32.4(Vss) U32.9(TP) X15.2 X15.10 ; port GND
CONF_DONE: R106.1 ; port FPGA_SYS.CONF_DONE, port FPGA_SYS_FMC.CONF_DONE  [project net FPGA_SYS.CONF_DONE]
CRC_ERROR: R108.1 ; port FPGA_SYS.CRC_ERROR, port FPGA_SYS_FMC.CRC_ERROR  [project net FPGA_SYS.CRC_ERROR]
FLASH_AS_DATA_0: R100.2 ; port QSPI_BUS.FLASH_AS_DATA_0
FLASH_ASDO: R171.2 ; port QSPI_BUS.FLASH_ASDO
FLASH_DCLK: U32.6(SCK) ; port QSPI_BUS.FLASH_DCLK
FLASH_NCSO: U32.1(~{CS}) ; port QSPI_BUS.FLASH_NCSO
FMC_TCK: D4.3(СH2) R103.2 R183.2 X15.1
FMC_TDI: D4.6(СH4) R101.1 R183.1 X15.9
FMC_TDO: D4.4(СH3) R183.3 X15.3
FMC_TMS: D4.1(СH1) R102.1 R183.4 X15.5
FPGA_SYS.TCK: R183.7 ; port FPGA_SYS.TCK
FPGA_SYS.TDI: R183.8 ; port FPGA_SYS.TDI
FPGA_SYS.TDO: R183.6 ; port FPGA_SYS.TDO
FPGA_SYS.TMS: R183.5 ; port FPGA_SYS.TMS
INIT_DONE: R107.1 ; port FPGA_SYS.INIT_DONE, port FPGA_SYS_FMC.INIT_DONE  [project net FPGA_SYS.INIT_DONE]
MSEL_0: RJ6.1 U22.5(2Y) ; port FPGA_SYS.MSEL_0  [project net FPGA_SYS.MSEL_0]
MSEL_1: RJ4.1 U22.7(1Y) ; port FPGA_SYS.MSEL_1  [project net FPGA_SYS.MSEL_1]
MSEL_2: RJ2.1 ; port FPGA_SYS.MSEL_2  [project net FPGA_SYS.MSEL_2]
MSEL_3: RJ1.1 ; port FPGA_SYS.MSEL_3  [project net FPGA_SYS.MSEL_3]
MSEL_FMC_0: RJ3.1 U22.3(2A) ; port FPGA_SYS_FMC.MSEL_FMC_0
MSEL_FMC_1: RJ5.1 U22.1(1A) ; port FPGA_SYS_FMC.MSEL_FMC_1
nCONFIG: R105.1 ; port FPGA_SYS.nCONFIG, port FPGA_SYS_FMC.nCONFIG  [project net FPGA_SYS.nCONFIG]
nSTATUS: R104.1 ; port FPGA_SYS.nSTATUS, port FPGA_SYS_FMC.nSTATUS  [project net FPGA_SYS.nSTATUS]
NetR100_1: R100.1 U32.2(SO/IO1)
NetR171_1: R171.1 U32.5(SI/IO0)
NetR182_2: R182.2 U32.3(~{WP}/IO2)
NetR184_2: R184.2 U32.7(~{HOLD}/IO3)

Not connected (* = marked no-connect by the designer): U22 2(3Y)* 6(3A)*; X15 6* 7* 8*

### Notes on the sheet
- В документации на подключение EPCQ не достаточно понятно написано, как подключать к линиям ПЛИС. Обратить внимания при проверке платы.
- JTAG connector
- (near U22) Проверить после монтажа платы:
  MSEL_FMC_1 - 1
  MSEL_FMC_0 - 0
- (near RJ1) AS, standard - 0010
  PS, standard - 0000
- Подп. и дата
- Инв. № дубл.
- Взам. инв. №
- Инв. № подл.
- Изм.
- Лист
- № докум.
- Подп.
- Дата
- Форма 2а ГОСТ 2.104-2006
- Копировал
- Формат А4

### Library data of the parts
C141 C142 = Capacitor: as C124 on sheet llrf_afe_pwr_ctrl; Value: 0.1мкФ
D4 = DRTR5V0U4S: 4 CHANNEL LOW CAPACITANCE TVS DIODE ARRAY; Потребление, Вт: 0.0; Назначение: 4 CHANNEL LOW CAPACITANCE TVS DIODE ARRAY; ComponentLink1Description: DataSheet; ComponentLink1URL: DRTR5V0U4S; Supplier 1: Digi-Key; Supplier Part Number 1: DRTR5V0U4S-7DICT-ND
R100 R171 = Resistor: as R51 on sheet llrf_afe_pwr_ctrl; Value: 33
R101-R108 R182 R184 = Resistor: as R52-R56 on sheet llrf_afe_pwr_ctrl
  R101 R102 R104-R108: Value: 10к
  R103: Value: 1к
  R182 R184: Value: 4к7
R183 = Resistor-4: Потребление, Вт: 0.0; Наименование: TC124-FR-0733RL; Назначение: 4 Chip Resistor Array; Описание: TC124-FR-0733RL
RJ1-RJ6 = Resistor_Jamper: Resistor-Jumper; Назначение: Резистор для выбора режима; Наименование: Резистор; Потребление, Вт: 0,0
  RJ1 RJ2: Value: 0
  RJ3 RJ5: Value: 10к
  RJ4 RJ6: Value: NU
U22 = NC7NZ34: TinyLogic UHS Triple Buffer; Потребление, Вт: 0.01; Назначение: TinyLogic UHS Triple Buffer; ComponentLink1Description: DataSheet; ComponentLink1URL: https://www.onsemi.com/pdf/datasheet/nc7nz34-d.pdf; Supplier 1: Digi-Key; Supplier Part Number 1: NC7NZ34K8XCT-ND
U32 = S25FL128SAGN: Programmable NOR flash memory; Потребление, Вт: 0.1; Назначение: Programmable NOR flash memory
X15 = Header 2X10: Header, 10-Pin, Dual row; Потребление, Вт: 0,0; Назначение: Header, 10-Pin, Dual row; Наименование: DS1013-10R

## Sheet llrf_afe_reserve_io.SchDoc: =GlobalProjectName
size 209 x 297 mm; Author: Styuf Alexey; Organization: CosyLab Siberia; Revision: v0.8; SheetNumber: Лист; SheetTotal: Листов; PageSetup: Record=PageOptions|CenterHorizontal=True|CenterVertical=True|PrintScale=1.00|XCorrection=1.00|YCorrection=1.00|PrintKind=1|BorderSize=5000000|LeftOffset=0|BottomOffset=0|Orientation=2|PaperLength=1000|PaperWidth=1000|Scale=100|PaperSource=15|PrintQuality=1200|MediaType=1|DitherType=10|PaperKind=A3|PrintScaleMode=1; Weight: -; ScaleFactor: -
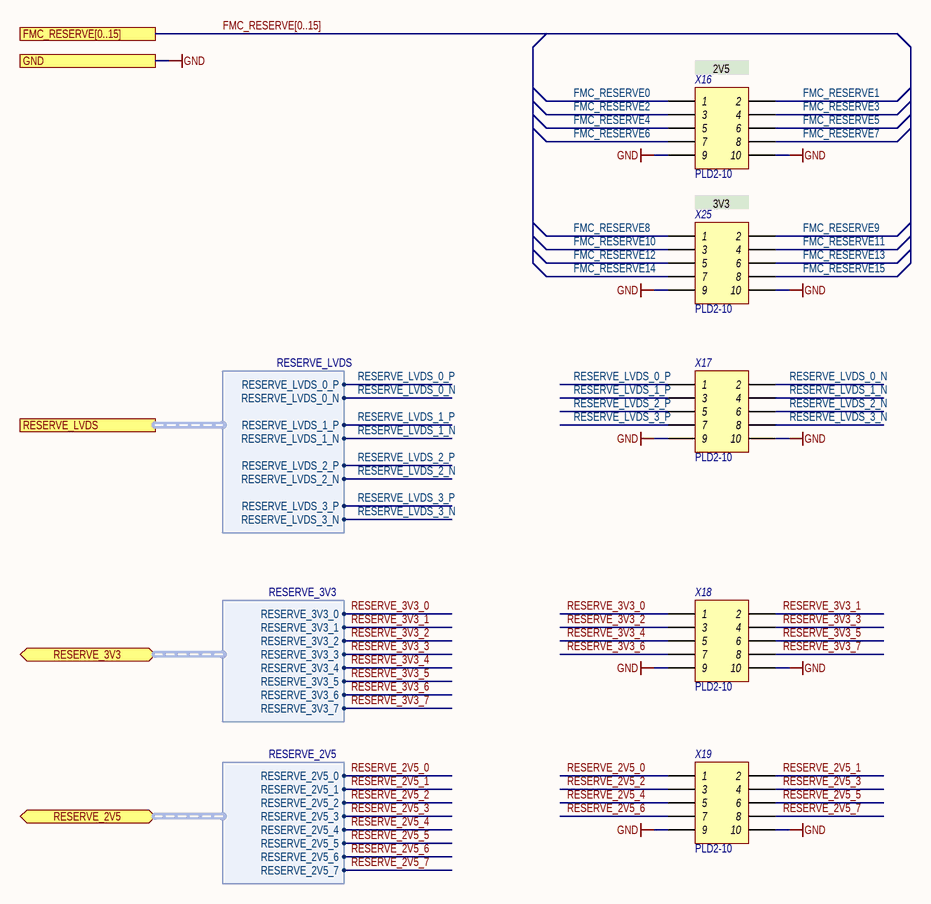
[diagram p19: llrf_afe_reserve_io.SchDoc]

### Parts
X16  Header 2X10  [PLD2-10]  (value not drawn)
X17  Header 2X10  [PLD2-10]  (value not drawn)
X18  Header 2X10  [PLD2-10]  (value not drawn)
X19  Header 2X10  [PLD2-10]  (value not drawn)
X25  Header 2X10  [PLD2-10]  (value not drawn)

### Ports
FMC_RESERVE[0..15], GND, RESERVE_2V5 (bidir, harness RESERVE_2V5), RESERVE_3V3 (bidir, harness RESERVE_3V3), RESERVE_LVDS (harness RESERVE_LVDS)

### Harnesses
RESERVE_LVDS: RESERVE_LVDS_0_P, RESERVE_LVDS_0_N, RESERVE_LVDS_1_P, RESERVE_LVDS_1_N, RESERVE_LVDS_2_P, RESERVE_LVDS_2_N, RESERVE_LVDS_3_P, RESERVE_LVDS_3_N
RESERVE_3V3: RESERVE_3V3_0, RESERVE_3V3_1, RESERVE_3V3_2, RESERVE_3V3_3, RESERVE_3V3_4, RESERVE_3V3_5, RESERVE_3V3_6, RESERVE_3V3_7
RESERVE_2V5: RESERVE_2V5_0, RESERVE_2V5_1, RESERVE_2V5_2, RESERVE_2V5_3, RESERVE_2V5_4, RESERVE_2V5_5, RESERVE_2V5_6, RESERVE_2V5_7

### Nets
GND: X16.9 X16.10 X17.9 X17.10 X18.9 X18.10 X19.9 X19.10 X25.9 X25.10 ; port GND
FMC_RESERVE0: X16.1
FMC_RESERVE1: X16.2
FMC_RESERVE2: X16.3
FMC_RESERVE3: X16.4
FMC_RESERVE4: X16.5
FMC_RESERVE5: X16.6
FMC_RESERVE6: X16.7
FMC_RESERVE7: X16.8
FMC_RESERVE8: X25.1
FMC_RESERVE9: X25.2
FMC_RESERVE10: X25.3
FMC_RESERVE11: X25.4
FMC_RESERVE12: X25.5
FMC_RESERVE13: X25.6
FMC_RESERVE14: X25.7
FMC_RESERVE15: X25.8
RESERVE_2V5_0: X19.1 ; port RESERVE_2V5.RESERVE_2V5_0
RESERVE_2V5_1: X19.2 ; port RESERVE_2V5.RESERVE_2V5_1
RESERVE_2V5_2: X19.3 ; port RESERVE_2V5.RESERVE_2V5_2
RESERVE_2V5_3: X19.4 ; port RESERVE_2V5.RESERVE_2V5_3
RESERVE_2V5_4: X19.5 ; port RESERVE_2V5.RESERVE_2V5_4
RESERVE_2V5_5: X19.6 ; port RESERVE_2V5.RESERVE_2V5_5
RESERVE_2V5_6: X19.7 ; port RESERVE_2V5.RESERVE_2V5_6
RESERVE_2V5_7: X19.8 ; port RESERVE_2V5.RESERVE_2V5_7
RESERVE_3V3_0: X18.1 ; port RESERVE_3V3.RESERVE_3V3_0
RESERVE_3V3_1: X18.2 ; port RESERVE_3V3.RESERVE_3V3_1
RESERVE_3V3_2: X18.3 ; port RESERVE_3V3.RESERVE_3V3_2
RESERVE_3V3_3: X18.4 ; port RESERVE_3V3.RESERVE_3V3_3
RESERVE_3V3_4: X18.5 ; port RESERVE_3V3.RESERVE_3V3_4
RESERVE_3V3_5: X18.6 ; port RESERVE_3V3.RESERVE_3V3_5
RESERVE_3V3_6: X18.7 ; port RESERVE_3V3.RESERVE_3V3_6
RESERVE_3V3_7: X18.8 ; port RESERVE_3V3.RESERVE_3V3_7
RESERVE_LVDS_0_N: X17.2 ; port RESERVE_LVDS.RESERVE_LVDS_0_N
RESERVE_LVDS_0_P: X17.1 ; port RESERVE_LVDS.RESERVE_LVDS_0_P
RESERVE_LVDS_1_N: X17.4 ; port RESERVE_LVDS.RESERVE_LVDS_1_N
RESERVE_LVDS_1_P: X17.3 ; port RESERVE_LVDS.RESERVE_LVDS_1_P
RESERVE_LVDS_2_N: X17.6 ; port RESERVE_LVDS.RESERVE_LVDS_2_N
RESERVE_LVDS_2_P: X17.5 ; port RESERVE_LVDS.RESERVE_LVDS_2_P
RESERVE_LVDS_3_N: X17.8 ; port RESERVE_LVDS.RESERVE_LVDS_3_N
RESERVE_LVDS_3_P: X17.7 ; port RESERVE_LVDS.RESERVE_LVDS_3_P

### Buses and harness runs
bus FMC_RESERVE[0..15] = port FMC_RESERVE[0..15]

### Notes on the sheet
- (near X16) 2V5
- 3V3
- Подп. и дата
- Инв. № дубл.
- Взам. инв. №
- Инв. № подл.
- Изм.
- Лист
- № докум.
- Подп.
- Дата
- Форма 2а ГОСТ 2.104-2006
- Копировал
- Формат А4

### Library data of the parts
X16-X19 X25 = Header 2X10: as X15 on sheet llrf_afe_fpga_conf; Назначение: Header, 10-Pin, Dual row; Наименование: PLD2-10

## Sheet llrf_afe_dds_channel.SchDoc
size 209 x 297 mm; SheetNumber: 2; SheetTotal: 17
Used 2 times, as channels dds_channel_1, dds_channel_2. Parts and nets are listed once, with the designators drawn on the sheet.
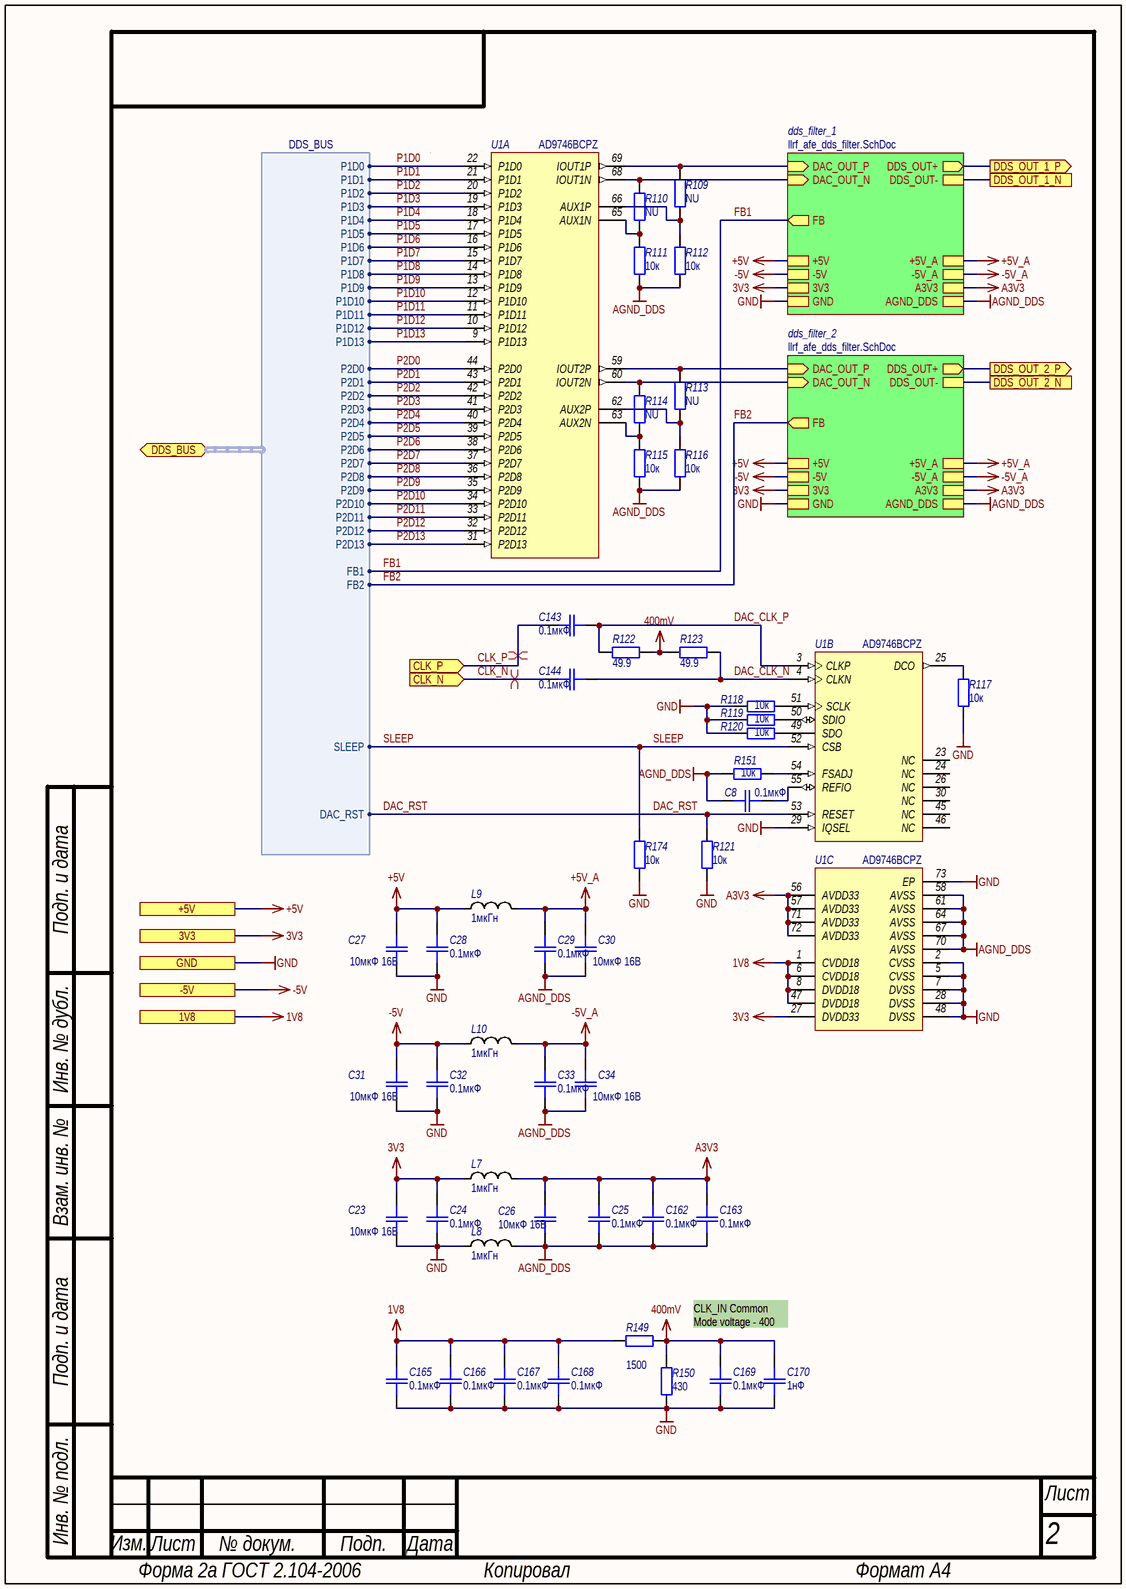
[diagram p20: llrf_afe_dds_channel.SchDoc]

### Parts
C8  0.1мкФ  [SMD_C0402]
C23  10мкФ 16В  [SMD_C0603]
C24  0.1мкФ  [SMD_C0402]
C25  0.1мкФ  [SMD_C0402]
C26  10мкФ 16В  [SMD_C0603]
C27  10мкФ 16В  [SMD_C0603]
C28  0.1мкФ  [SMD_C0402]
C29  0.1мкФ  [SMD_C0402]
C30  10мкФ 16В  [SMD_C0603]
C31  10мкФ 16В  [SMD_C0603]
C32  0.1мкФ  [SMD_C0402]
C33  0.1мкФ  [SMD_C0402]
C34  10мкФ 16В  [SMD_C0603]
C143  0.1мкФ  [SMD_C0402]
C144  0.1мкФ  [SMD_C0402]
C162  0.1мкФ  [SMD_C0402]
C163  0.1мкФ  [SMD_C0402]
C165  0.1мкФ  [SMD_C0402]
C166  0.1мкФ  [SMD_C0402]
C167  0.1мкФ  [SMD_C0402]
C168  0.1мкФ  [SMD_C0402]
C169  0.1мкФ  [SMD_C0402]
C170  1нФ  [SMD_C0402]
L7  1мкГн  [SMD_0805]
L8  1мкГн  [SMD_0805]
L9  1мкГн  [SMD_0805]
L10  1мкГн  [SMD_0805]
R109  NU  [SMD_0603]
R110  NU  [SMD_0603]
R111  10к  [SMD_0603]
R112  10к  [SMD_0603]
R113  NU  [SMD_0603]
R114  NU  [SMD_0603]
R115  10к  [SMD_0603]
R116  10к  [SMD_0603]
R117  10к  [SMD_0603]
R118  10к  [SMD_0603]
R119  10к  [SMD_0603]
R120  10к  [SMD_0603]
R121  10к  [SMD_0603]
R122  49.9  [SMD_0603]
R123  49.9  [SMD_0603]
R149  1500  [SMD_0603]
R150  430  [SMD_0603]
R151  10к  [SMD_0603]
R174  10к  [SMD_0603]
U1  AD9746BCPZ  [LFCSP-72]  (parts A,B,C of 3)

### Sub-sheets
dds_filter_1 = llrf_afe_dds_filter.SchDoc: DAC_OUT_P (in), -5V, DAC_OUT_N (in), +5V, GND, FB (out), +5V_A, DDS_OUT+ (out), A3V3, 3V3, AGND_DDS, -5V_A, DDS_OUT-
dds_filter_2 = llrf_afe_dds_filter.SchDoc: DAC_OUT_P (in), -5V, DAC_OUT_N (in), +5V, GND, FB (out), +5V_A, DDS_OUT+ (out), A3V3, 3V3, AGND_DDS, -5V_A, DDS_OUT-

### Ports
1V8, 3V3, +5V, -5V, CLK_N (in), CLK_P (in), DDS_BUS (bidir, harness DDS_BUS), DDS_OUT_1_N, DDS_OUT_1_P (out), DDS_OUT_2_N, DDS_OUT_2_P (out), GND

### Harnesses
DDS_BUS: P1D0, P1D1, P1D2, P1D3, P1D4, P1D5, P1D6, P1D7, P1D8, P1D9, P1D10, P1D11, P1D12, P1D13, P2D0, P2D1, P2D2, P2D3, P2D4, P2D5, P2D6, P2D7, P2D8, P2D9, P2D10, P2D11, P2D12, P2D13, FB1, SLEEP, DAC_RST, FB2

### Nets
1V8: C165.2 C166.2 C167.2 C168.2 R149.2 U1.1(CVDD18) U1.6(CVDD18) U1.8(DVDD18) U1.47(DVDD18) ; port 1V8
3V3: C23.2 C24.2 L7.1 U1.27(DVDD33) ; port 3V3, sheet dds_filter_1/3V3, sheet dds_filter_2/3V3
400mV: C169.1 C170.1 R122.1 R123.2 R149.1 R150.2
+5V: C27.2 C28.2 L9.1 ; port +5V, sheet dds_filter_1/+5V, sheet dds_filter_2/+5V
+5V_A: C29.2 C30.2 L9.2 ; sheet dds_filter_1/+5V_A, sheet dds_filter_2/+5V_A
-5V: C31.2 C32.2 L10.1 ; port -5V, sheet dds_filter_1/-5V, sheet dds_filter_2/-5V
-5V_A: C33.2 C34.2 L10.2 ; sheet dds_filter_1/-5V_A, sheet dds_filter_2/-5V_A
A3V3: C25.2 C26.2 C162.2 C163.2 L7.2 U1.56(AVDD33) U1.57(AVDD33) U1.71(AVDD33) U1.72(AVDD33) ; sheet dds_filter_1/A3V3, sheet dds_filter_2/A3V3
AGND_DDS: C8.1 C25.1 C26.1 C29.1 C30.1 C33.1 C34.1 C162.1 C163.1 L8.2 R111.1 R112.1 R115.1 R116.1 R151.1 U1.58(AVSS) U1.61(AVSS) U1.64(AVSS) U1.67(AVSS) U1.70(AVSS) ; sheet dds_filter_1/AGND_DDS, sheet dds_filter_2/AGND_DDS
GND: C23.1 C24.1 C27.1 C28.1 C31.1 C32.1 C165.1 C166.1 C167.1 C168.1 C169.2 C170.2 L8.1 R117.1 R118.2 R119.2 R120.2 R121.1 R150.1 R174.1 U1.2(CVSS) U1.5(CVSS) U1.7(DVSS) U1.28(DVSS) U1.29(IQSEL) U1.48(DVSS) U1.73(EP) ; port GND, sheet dds_filter_1/GND, sheet dds_filter_2/GND
CLK_N: C144.2 ; port CLK_N
CLK_P: C143.2 ; port CLK_P
DAC_CLK_N: C144.1 R123.1 U1.4(CLKN)
DAC_CLK_P: C143.1 R122.2 U1.3(CLKP)
DAC_RST: R121.2 U1.53(RESET) ; port DDS_BUS.DAC_RST
DDS_OUT_1_N: port DDS_OUT_1_N, sheet dds_filter_1/DDS_OUT-
DDS_OUT_1_P: port DDS_OUT_1_P, sheet dds_filter_1/DDS_OUT+
DDS_OUT_2_N: port DDS_OUT_2_N, sheet dds_filter_2/DDS_OUT-
DDS_OUT_2_P: port DDS_OUT_2_P, sheet dds_filter_2/DDS_OUT+
FB1: sheet dds_filter_1/FB, port DDS_BUS.FB1
FB2: sheet dds_filter_2/FB, port DDS_BUS.FB2
P1D0: U1.22(P1D0) ; port DDS_BUS.P1D0
P1D1: U1.21(P1D1) ; port DDS_BUS.P1D1
P1D2: U1.20(P1D2) ; port DDS_BUS.P1D2
P1D3: U1.19(P1D3) ; port DDS_BUS.P1D3
P1D4: U1.18(P1D4) ; port DDS_BUS.P1D4
P1D5: U1.17(P1D5) ; port DDS_BUS.P1D5
P1D6: U1.16(P1D6) ; port DDS_BUS.P1D6
P1D7: U1.15(P1D7) ; port DDS_BUS.P1D7
P1D8: U1.14(P1D8) ; port DDS_BUS.P1D8
P1D9: U1.13(P1D9) ; port DDS_BUS.P1D9
P1D10: U1.12(P1D10) ; port DDS_BUS.P1D10
P1D11: U1.11(P1D11) ; port DDS_BUS.P1D11
P1D12: U1.10(P1D12) ; port DDS_BUS.P1D12
P1D13: U1.9(P1D13) ; port DDS_BUS.P1D13
P2D0: U1.44(P2D0) ; port DDS_BUS.P2D0
P2D1: U1.43(P2D1) ; port DDS_BUS.P2D1
P2D2: U1.42(P2D2) ; port DDS_BUS.P2D2
P2D3: U1.41(P2D3) ; port DDS_BUS.P2D3
P2D4: U1.40(P2D4) ; port DDS_BUS.P2D4
P2D5: U1.39(P2D5) ; port DDS_BUS.P2D5
P2D6: U1.38(P2D6) ; port DDS_BUS.P2D6
P2D7: U1.37(P2D7) ; port DDS_BUS.P2D7
P2D8: U1.36(P2D8) ; port DDS_BUS.P2D8
P2D9: U1.35(P2D9) ; port DDS_BUS.P2D9
P2D10: U1.34(P2D10) ; port DDS_BUS.P2D10
P2D11: U1.33(P2D11) ; port DDS_BUS.P2D11
P2D12: U1.32(P2D12) ; port DDS_BUS.P2D12
P2D13: U1.31(P2D13) ; port DDS_BUS.P2D13
SLEEP: R174.2 U1.52(CSB) ; port DDS_BUS.SLEEP
NetC8_2: C8.2 U1.55(REFIO)
NetR109_1: R109.1 R112.2 U1.66(AUX1P)
NetR109_2: R109.2 U1.69(IOUT1P) ; sheet dds_filter_1/DAC_OUT_P
NetR110_1: R110.1 R111.2 U1.65(AUX1N)
NetR110_2: R110.2 U1.68(IOUT1N) ; sheet dds_filter_1/DAC_OUT_N
NetR113_1: R113.1 R116.2 U1.62(AUX2P)
NetR113_2: R113.2 U1.59(IOUT2P) ; sheet dds_filter_2/DAC_OUT_P
NetR114_1: R114.1 R115.2 U1.63(AUX2N)
NetR114_2: R114.2 U1.60(IOUT2N) ; sheet dds_filter_2/DAC_OUT_N
NetR117_2: R117.2 U1.25(DCO)
NetR118_1: R118.1 U1.51(SCLK)
NetR119_1: R119.1 U1.50(SDIO)
NetR120_1: R120.1 U1.49(SDO)
NetR151_2: R151.2 U1.54(FSADJ)

Not connected (* = marked no-connect by the designer): U1 23(NC) 24(NC) 26(NC) 30(NC) 45(NC) 46(NC)

### Channels
dds_channel_1: designators end in _dds_channel_1; ports 1V8=1V8 3V3=3V3 +5V=+5V -5V=-5V CLK_N=CLK0_N CLK_P=CLK0_P DDS_OUT_1_N=DDS_OUT-_1 DDS_OUT_1_P=DDS_OUT+_1 DDS_OUT_2_N=DDS_OUT-_2 DDS_OUT_2_P=DDS_OUT+_2 GND=GND
dds_channel_2: designators end in _dds_channel_2; ports 1V8=1V8 3V3=3V3 +5V=+5V -5V=-5V CLK_N=CLK1_N CLK_P=CLK1_P DDS_OUT_1_N=DDS_OUT-_3 DDS_OUT_1_P=DDS_OUT+_3 DDS_OUT_2_N=DDS_OUT-_4 DDS_OUT_2_P=DDS_OUT+_4 GND=GND

### Layout directives
differential pair: CLK0_N, CLK0_P

### Notes on the sheet
- CLK_IN Common Mode voltage - 400 mV
- Подп. и дата
- Инв. № дубл.
- Взам. инв. №
- Инв. № подл.
- Изм.
- Лист
- № докум.
- Подп.
- Дата
- Форма 2а ГОСТ 2.104-2006
- Копировал
- Формат А4

### Library data of the parts
C8 C24 C25 C28 C29 C32 C33 C143 C144 C162 C163 C165-C170 = Capacitor: as C124 on sheet llrf_afe_pwr_ctrl
  C8 C24 C25 C28 C29 C32 C33 C143 C144 C162 C163 C165-C169: Value: 0.1мкФ
  C170: Value: 1нФ
C23 C26 C27 C30 C31 C34 = Capacitor: Назначение: SMD-конденсатор; Наименование: GRM188C81C106MA73; Потребление, Вт: 0; Value: 10мкФ 16В
L7-L10 = Inductor: as L5 on sheet llrf_afe_fpga_pwr; Value: 1мкГн
R109-R123 R149-R151 R174 = Resistor: as R52-R56 on sheet llrf_afe_pwr_ctrl
  R109 R110 R113 R114: Value: NU
  R111 R112 R115-R121 R151 R174: Value: 10к
  R122 R123: Value: 49.9
  R149: Value: 1500
  R150: Value: 430
U1 = AD9746BCPZ: Dual 14-Bit Digital-to-Analog Converter, 250 Msps, -40 to +85 degC, CP-72-1, Pb-Free, Tray; Потребление, Вт: 0.355; Назначение: Dual 14-Bit Digital-to-Analog Converter, 250 Msps, -40 to +85 degC, CP-72-1, Pb-Free, Tray; ComponentLink1Description: DataSheet; ComponentLink1URL: http://www.analog.com/static/imported-files/data_sheets/AD9741_9743_9745_9746_9747.pdf; Наименование: AD9746BCPZ

## Sheet llrf_afe_dds_filter.SchDoc: =GlobalProjectName
size 209 x 297 mm; Author: Styuf Alexey; Organization: CosyLab Siberia; Revision: v0.8; SheetNumber: 20; SheetTotal: 20; PageSetup: Record=PageOptions|CenterHorizontal=True|CenterVertical=True|PrintScale=1.00|XCorrection=1.00|YCorrection=1.00|PrintKind=1|BorderSize=5000000|LeftOffset=0|BottomOffset=0|Orientation=2|PaperLength=1000|PaperWidth=1000|Scale=100|PaperSource=15|PrintQuality=1200|MediaType=1|DitherType=10|PaperKind=A3|PrintScaleMode=1; Weight: -; ScaleFactor: -
Used 4 times, as channels dds_channel_1/dds_filter_1, dds_channel_1/dds_filter_2, dds_channel_2/dds_filter_1, dds_channel_2/dds_filter_2. Parts and nets are listed once, with the designators drawn on the sheet.
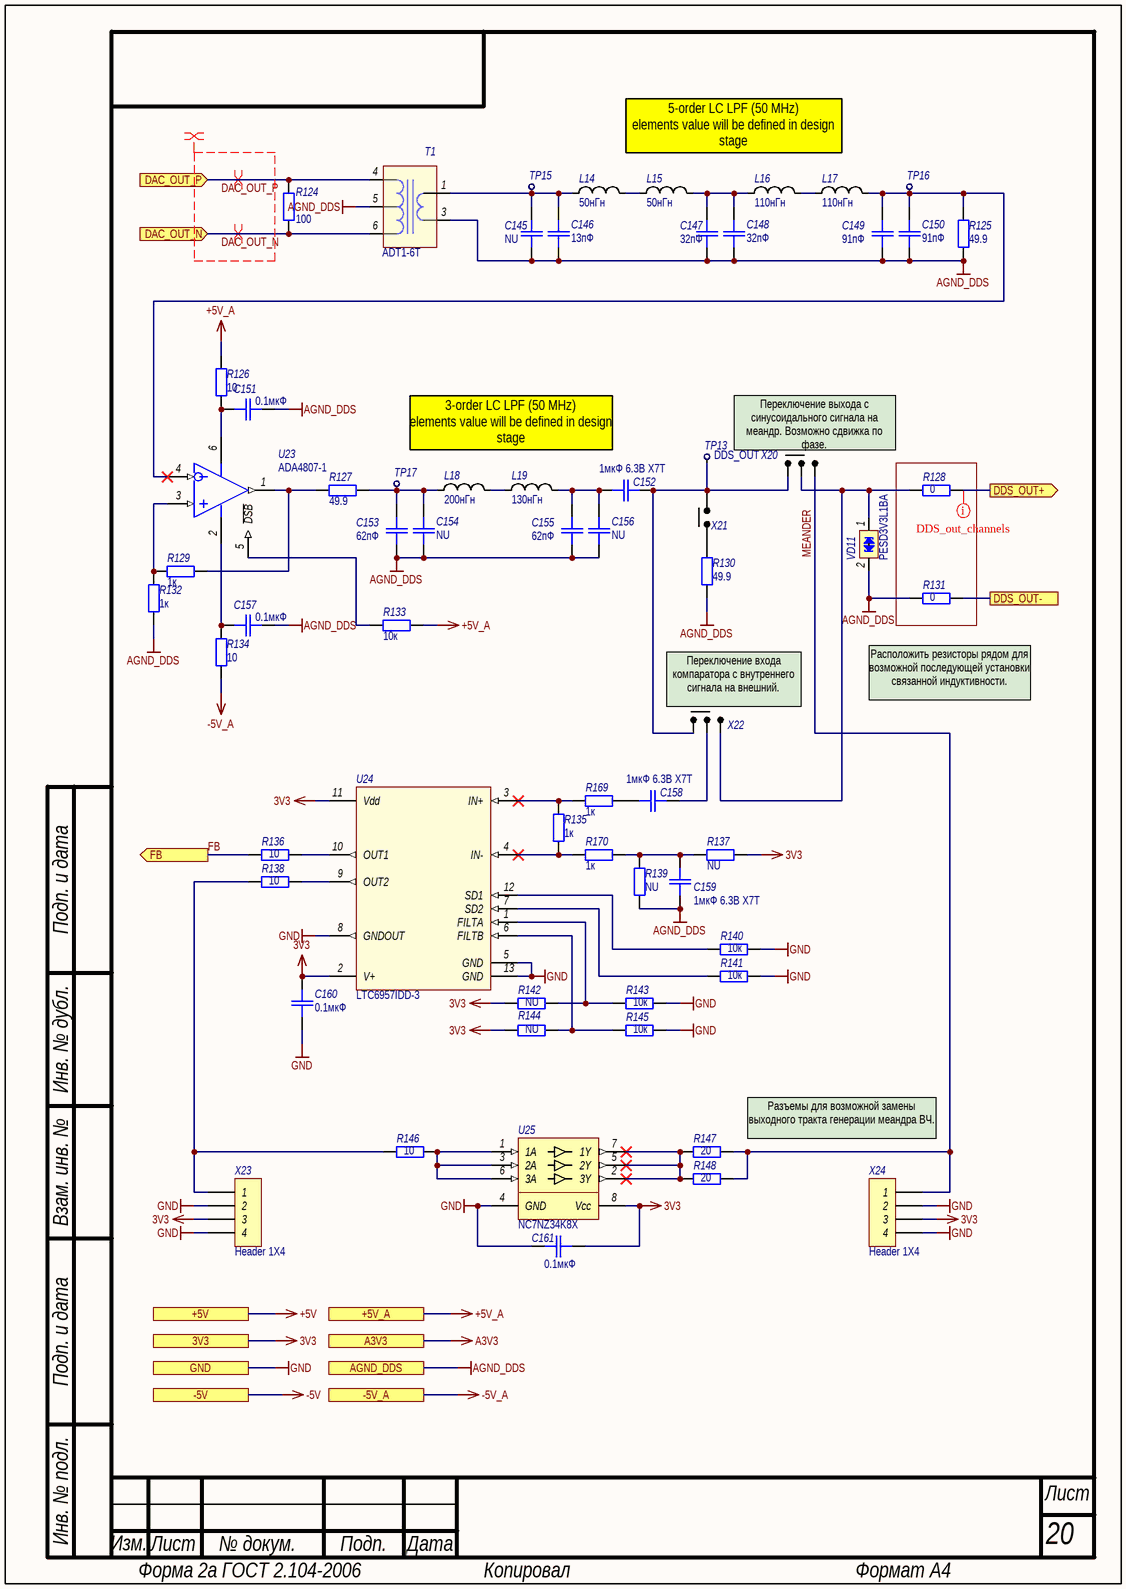
[diagram p21: llrf_afe_dds_filter.SchDoc]

### Parts
C145  NU  [SMD_C0603]
C146  13пФ  [SMD_C0603]
C147  32пФ  [SMD_C0603]
C148  32пФ  [SMD_C0603]
C149  91пФ  [SMD_C0603]
C150  91пФ  [SMD_C0603]
C151  0.1мкФ  [SMD_C0402]
C152  1мкФ 6.3В X7T  [SMD_C0603]
C153  62пФ  [SMD_C0603]
C154  NU  [SMD_C0603]
C155  62пФ  [SMD_C0603]
C156  NU  [SMD_C0603]
C157  0.1мкФ  [SMD_C0402]
C158  1мкФ 6.3В X7T  [SMD_C0603]
C159  1мкФ 6.3В X7T  [SMD_C0603]
C160  0.1мкФ  [SMD_C0402]
C161  0.1мкФ  [SMD_C0402]
L14  50нГн  [SMD_0805]
L15  50нГн  [SMD_0805]
L16  110нГн  [SMD_0805]
L17  110нГн  [SMD_0805]
L18  200нГн  [SMD_0805]
L19  130нГн  [SMD_0805]
R124  100  [SMD_0603]
R125  49.9  [SMD_0603]
R126  10  [SMD_0603]
R127  49.9  [SMD_0603]
R128  0  [SMD_0603]
R129  1к  [SMD_0603]
R130  49.9  [SMD_0603]
R131  0  [SMD_0603]
R132  1к  [SMD_0603]
R133  10к  [SMD_0603]
R134  10  [SMD_0603]
R135  1к  [SMD_0603]
R136  10  [SMD_0603]
R137  NU  [SMD_0603]
R138  10  [SMD_0603]
R139  NU  [SMD_0603]
R140  10к  [SMD_0603]
R141  10к  [SMD_0603]
R142  NU  [SMD_0603]
R143  10к  [SMD_0603]
R144  NU  [SMD_0603]
R145  10к  [SMD_0603]
R146  10  [SMD_0603]
R147  20  [SMD_1206]
R148  20  [SMD_1206]
R169  1к  [SMD_0603]
R170  1к  [SMD_0603]
T1  ADT1-6T  [ADT1-6T]
TP13  DDS_OUT  [TestPoint]
TP15  (no value)  [TestPoint]
TP16  (no value)  [TestPoint]
TP17  (no value)  [TestPoint]
U23  ADA4807-1  [SOT23-6]
U24  LTC6957IDD-3  [DFN-12_EP_3x3_0.45]
U25  Наименование: NC7NZ34K8X  [US-8]  (hidden comment: NC7NZ34)
VD11  Наименование: PESD3V3L1BA  [SOD-323]  (hidden comment: PESD3V3)
X20  Jumper 3  [PLS-3]  (value not drawn)
X21  Jumper 2  [PLS-2]  (value not drawn)
X22  Jumper 3  [PLS-3]  (value not drawn)
X23  Header 1X4  [PLS-4]
X24  Header 1X4  [PLS-4]

### Ports
3V3, +5V, +5V_A, -5V, -5V_A, A3V3, AGND_DDS, DAC_OUT_N (in), DAC_OUT_P (in), DDS_OUT+ (out), DDS_OUT-, FB (out), GND

### Nets
3V3: C160.1 C161.1 R137.2 R142.2 R144.2 U24.2(V+) U24.11(Vdd) U25.8(Vcc) X23.3 X24.3 ; port 3V3
+5V: port +5V
+5V_A: R126.1 R133.2 ; port +5V_A
-5V: port -5V
-5V_A: R134.1 ; port -5V_A
A3V3: port A3V3
AGND_DDS: C145.2 C146.2 C147.2 C148.2 C149.2 C150.2 C151.1 C153.2 C154.2 C155.2 C156.2 C157.1 C159.2 R125.1 R130.1 R131.1 R132.1 R139.1 T1.3 T1.5 VD11.2(cathode_2) ; port AGND_DDS
GND: C160.2 C161.2 R140.1 R141.1 R143.1 R145.1 U24.5(GND) U24.8(GNDOUT) U24.13(GND) U25.4(GND) X23.2 X23.4 X24.2 X24.4 ; port GND
DAC_OUT_N: R124.2 T1.6 ; port DAC_OUT_N
DAC_OUT_P: R124.1 T1.4 ; port DAC_OUT_P
DDS_OUT+: R128.2 ; port DDS_OUT+
DDS_OUT-: R131.2 ; port DDS_OUT-
FB: R136.1 ; port FB
MEANDER: R147.2 R148.2 X20.3 X24.1
NetC145_1: C145.1 C146.1 L14.1 T1.1 TP15.0(TP)
NetC147_1: C147.1 C148.1 L15.2 L16.1
NetC149_1: C149.1 C150.1 L17.2 R125.2 TP16.0(TP) U23.4(IN-)
NetC151_2: C151.2 R126.2 U23.6(V+)
NetC152_1: C152.1 TP13.0(TP) X20.1 X21.2 X22.1
NetC152_2: C152.2 C155.1 C156.1 L19.2
NetC153_1: C153.1 C154.1 L18.1 R127.2 TP17.0(TP)
NetC157_2: C157.2 R134.2 U23.2(V-)
NetC158_1: C158.1 X22.2
NetC158_2: C158.2 R169.2
NetC159_1: C159.1 R137.1 R139.2 R170.2
NetL14_2: L14.2 L15.1
NetL16_2: L16.2 L17.1
NetL18_2: L18.2 L19.1
NetR127_1: R127.1 R129.2 U23.1(OUT)
NetR128_1: R128.1 VD11.1(cathode_1) X20.2 X22.3
NetR129_1: R129.1 R132.2 U23.3(IN+)
NetR130_2: R130.2 X21.1
NetR133_1: R133.1 U23.5(~{DSB})
NetR135_1: R135.1 R169.1 U24.3(IN+)
NetR135_2: R135.2 R170.1 U24.4(IN-)
NetR136_2: R136.2 U24.10(OUT1)
NetR138_1: R138.1 R146.1 X23.1
NetR138_2: R138.2 U24.9(OUT2)
NetR140_2: R140.2 U24.12(SD1)
NetR141_2: R141.2 U24.7(SD2)
NetR142_1: R142.1 R143.2 U24.1(FILTA)
NetR144_1: R144.1 R145.2 U24.6(FILTB)
NetR146_2: R146.2 U25.1(1A) U25.3(2A) U25.6(3A)
NetR147_1: R147.1 R148.1 U25.2(3Y) U25.5(2Y) U25.7(1Y)

### Channels
dds_channel_1/dds_filter_1: designators end in _dds_channel_1_dds_filter_1; ports 3V3=3V3 +5V=+5V +5V_A=+5V_A -5V=-5V -5V_A=-5V_A A3V3=A3V3 AGND_DDS=AGND_DDS DAC_OUT_N=DAC_OUT_N DAC_OUT_P=DAC_OUT_P DDS_OUT+=DDS_OUT+_1 DDS_OUT-=DDS_OUT-_1 FB=DDS_BUS_1.FB1 GND=GND
dds_channel_1/dds_filter_2: designators end in _dds_channel_1_dds_filter_2; ports 3V3=3V3 +5V=+5V +5V_A=+5V_A -5V=-5V -5V_A=-5V_A A3V3=A3V3 AGND_DDS=AGND_DDS DAC_OUT_N=DAC_OUT_N DAC_OUT_P=DAC_OUT_P DDS_OUT+=DDS_OUT+_2 DDS_OUT-=DDS_OUT-_2 FB=DDS_BUS_1.FB2 GND=GND
dds_channel_2/dds_filter_1: designators end in _dds_channel_2_dds_filter_1; ports 3V3=3V3 +5V=+5V +5V_A=+5V_A -5V=-5V -5V_A=-5V_A A3V3=A3V3 AGND_DDS=AGND_DDS DAC_OUT_N=DAC_OUT_N DAC_OUT_P=DAC_OUT_P DDS_OUT+=DDS_OUT+_3 DDS_OUT-=DDS_OUT-_3 FB=DDS_BUS_2.FB1 GND=GND
dds_channel_2/dds_filter_2: designators end in _dds_channel_2_dds_filter_2; ports 3V3=3V3 +5V=+5V +5V_A=+5V_A -5V=-5V -5V_A=-5V_A A3V3=A3V3 AGND_DDS=AGND_DDS DAC_OUT_N=DAC_OUT_N DAC_OUT_P=DAC_OUT_P DDS_OUT+=DDS_OUT+_4 DDS_OUT-=DDS_OUT-_4 FB=DDS_BUS_2.FB2 GND=GND

### Layout directives
differential pair: DAC_OUT_N, DAC_OUT_P
net class DDS_diff_pair: DAC_OUT_N, DAC_OUT_P
net class DDS_out_channels: DDS_OUT+_1

### Notes on the sheet
- 5-order LC LPF (50 MHz)
  elements value will be defined in design stage
- 3-order LC LPF (50 MHz)
  elements value will be defined in design stage
- (near X20) Переключение выхода с синусоидального сигнала на меандр. Возможно сдвижка по фазе.
- (near X22) Переключение входа компаратора с внутреннего сигнала на внешний.
- (near R131) Расположить резисторы рядом для возможной последующей установки связанной индуктивности.
- Разъемы для возможной замены выходного тракта генерации меандра ВЧ.
- Подп. и дата
- Инв. № дубл.
- Взам. инв. №
- Инв. № подл.
- Изм.
- Лист
- № докум.
- Подп.
- Дата
- Форма 2а ГОСТ 2.104-2006
- Копировал
- Формат А4

### Library data of the parts
C145-C151 C153-C157 C160 = Capacitor: as C124 on sheet llrf_afe_pwr_ctrl
  C145 C154 C156: Value: NU
  C146: Value: 13пФ
  C147 C148: Value: 32пФ
  C149 C150: Value: 91пФ
  C151 C157 C160: Value: 0.1мкФ
  C153 C155: Value: 62пФ
C152 C158 C159 = Capacitor: Назначение: SMD-конденсатор; Наименование: GRM033D70J105ME01; Потребление, Вт: 0; Value: 1мкФ 6.3В X7T
C161 = Capacitor: as C136 on sheet llrf_afe_pwr_input; Value: 0.1мкФ; Диэлектрик: *
L14-L19 = Inductor: Наименование: Индуктивность; Назначение: SMD-индуктивность; Потребление, Вт: 0.01
  L14 L15: Value: 50нГн
  L16 L17: Value: 110нГн
  L18: Value: 200нГн
  L19: Value: 130нГн
R124-R148 R169 R170 = Resistor: as R52-R56 on sheet llrf_afe_pwr_ctrl
  R124: Value: 100
  R125 R127 R130: Value: 49.9
  R126 R134 R136 R138 R146: Value: 10
  R128 R131: Value: 0
  R129 R132 R135 R169 R170: Value: 1к
  R133 R140 R141 R143 R145: Value: 10к
  R137 R139 R142 R144: Value: NU
  R147 R148: Value: 20
T1 = ADT1-6T: RF Transformer 50Ω 0.03 to 125MHz; Потребление, Вт: 0,01; Назначение: RF Transformer 50Ω 0.03 to 125MHz; ComponentLink1Description: DataSheet; ComponentLink1URL: https://www.minicircuits.com/pdfs/ADT1-6T.pdf; Наименование: ADT1-6T
TP13 TP15-TP17 = TP: as TP14 on sheet llrf_afe_pwr_ctrl
  TP13: TP_Name: DDS_OUT
U23 = ADA4807-1: Rail-to-Rail Input/Output Amplifiers, 3.1 nV/√Hz, 1 mA, 180 MHz; Потребление, Вт: 0,01; Назначение: Rail-to-Rail Input/Output Amplifiers, 3.1 nV/√Hz, 1 mA, 180 MHz; ComponentLink1Description: DataSheet; ComponentLink1URL: https://www.analog.com/media/en/technical-documentation/data-sheets/ADA4807-1_4807-2_4807-4.pdf; Наименование: ADA4807-1; Supplier 1: Digi-Key; Supplier Part Number 1: ADA4807-1AKSZ-R2CT-ND
U24 = LTC6957IDD-3: Low Phase Noise, Dual Output Buffer/Driver/Logic Converter; Назначение: Dual output clock buffer; Потребление, Вт: 0.1; Supplier 1: Arrow Electronics; Supplier Part Number 1: LTC6957IDD-3#PBF; Наименование: LTC6957IDD-3
U25 = NC7NZ34: as U22 on sheet llrf_afe_fpga_conf; Назначение: TinyLogic UHS Triple Buffer; ComponentLink1Description: DataSheet; ComponentLink1URL: https://www.onsemi.com/pdf/datasheet/nc7nz34-d.pdf; Supplier 1: Digi-Key; Supplier Part Number 1: NC7NZ34K8XCT-ND
VD11 = PESDxL1BA: as VD9 on sheet llrf_afe_usb_ftdi; ComponentLink1Description: DataSheet; ComponentLink1URL: https://static.chipdip.ru/lib/635/DOC005635911.pdf
X20 X22 = Jumper 3: Jumper, 3-Pin, Dual row; Потребление, Вт: 0,0; Наименование: Jumper 3-pin; Назначение: Jumper, 3-Pin, Dual row
X21 = Jumper 2: Jumper, 2-Pin, Dual row; Потребление, Вт: 0,0; Наименование: Jumper 2-pin; Назначение: Jumper, 2-Pin, Dual row
X23 X24 = Header 1X4: as X27 on sheet llrf_afe_usb_ftdi; Назначение: Header, 4-Pin, Single row; Наименование: Header 1X4